# EAGLE design micromouse-edu-finalV2.0.0 (EAGLE 9.4.2)
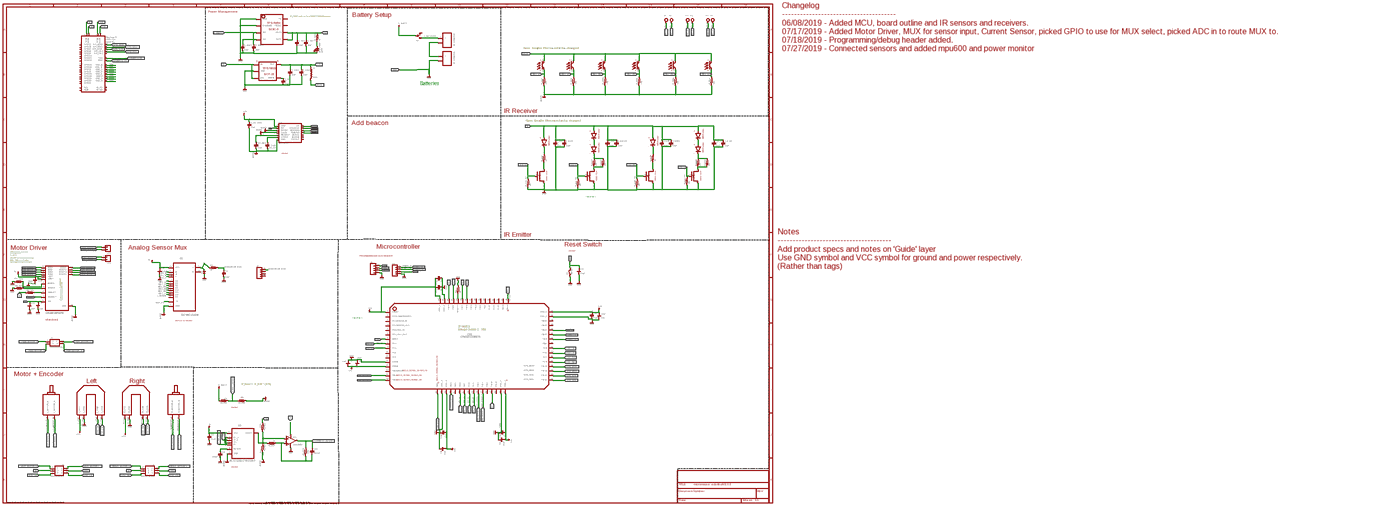
[diagram p0: schematic, sheet 1, overview]
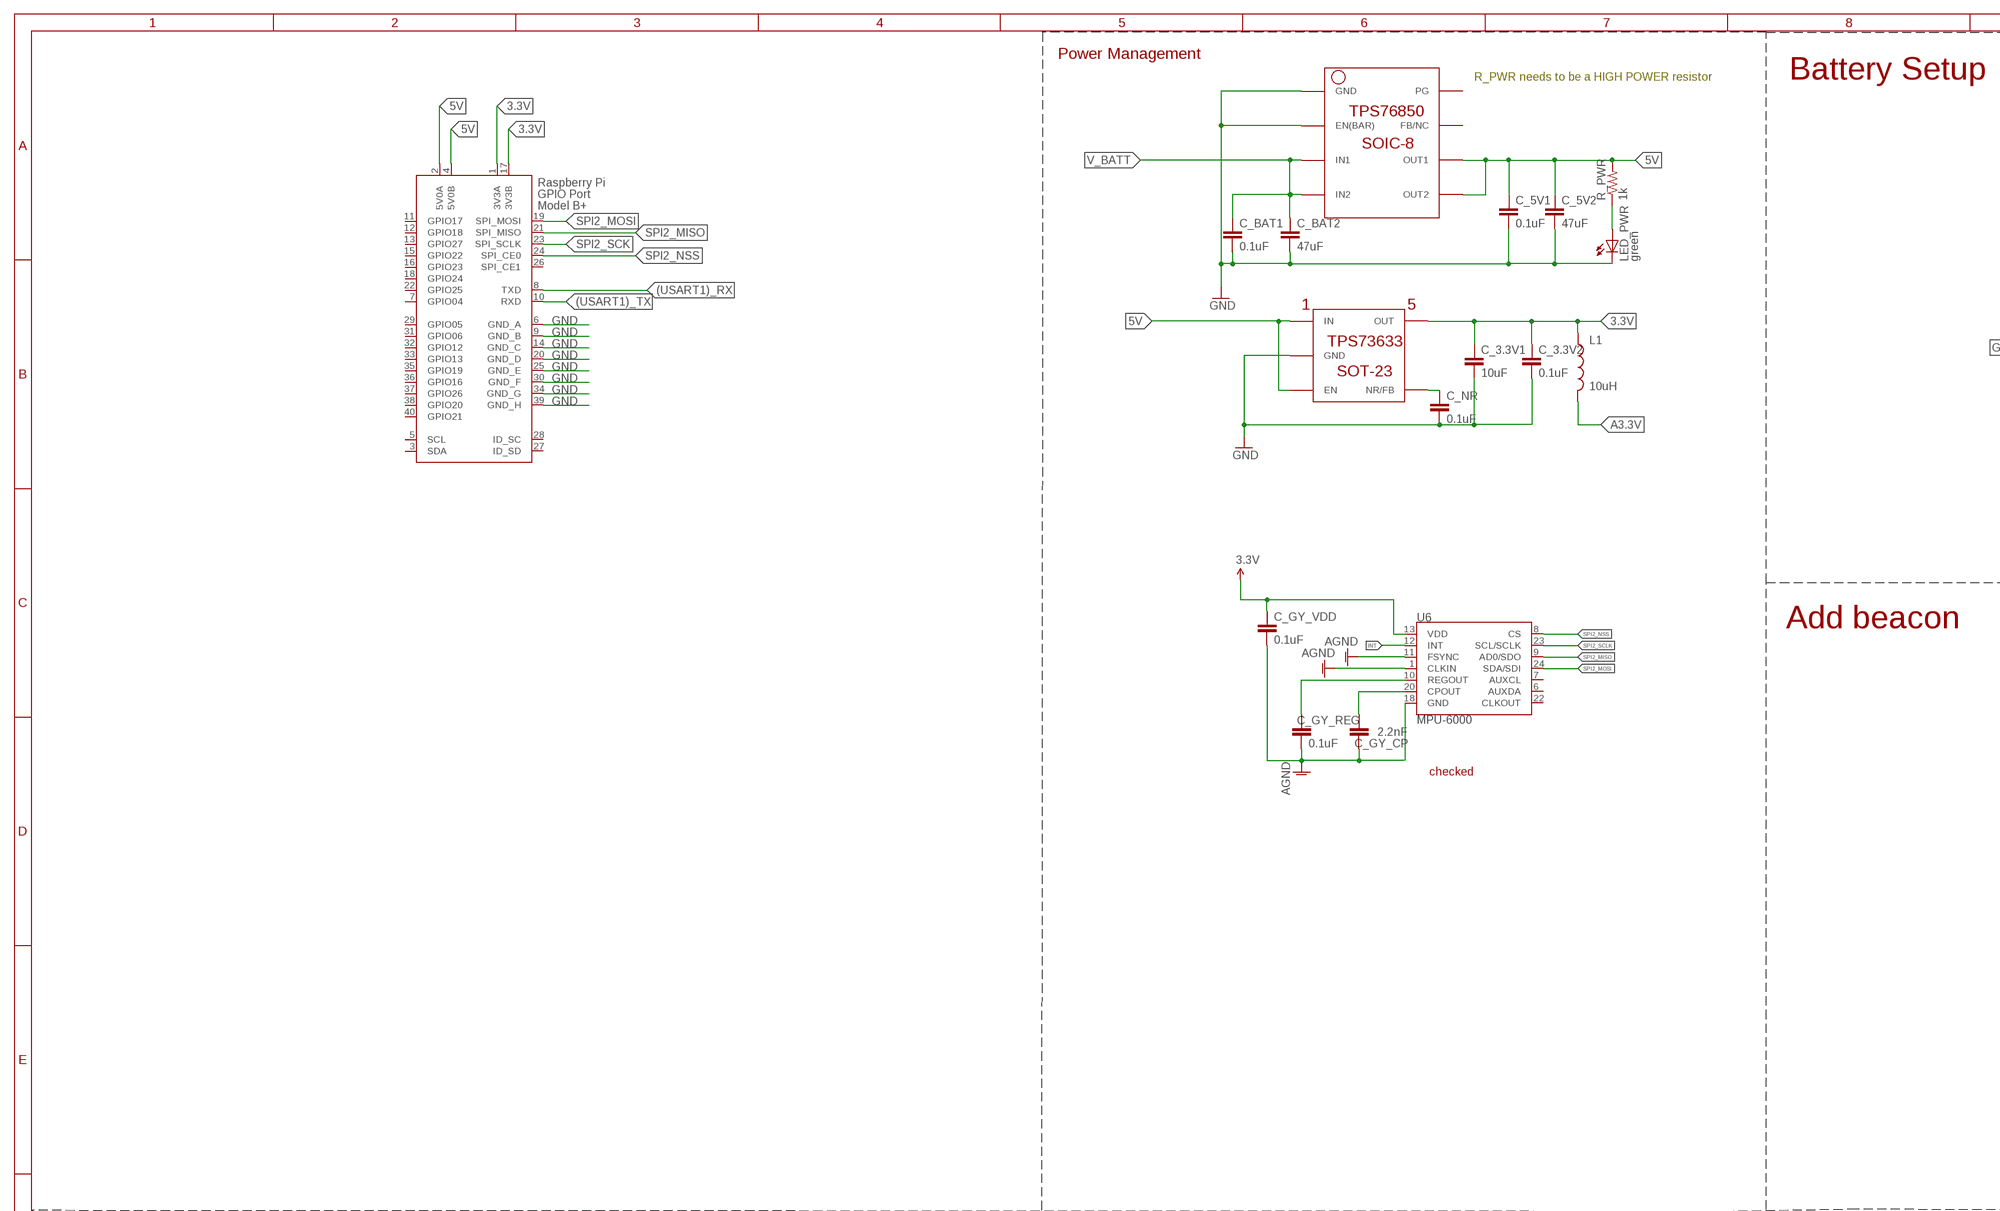
[diagram p1: schematic, sheet 1, part 1 of 6]
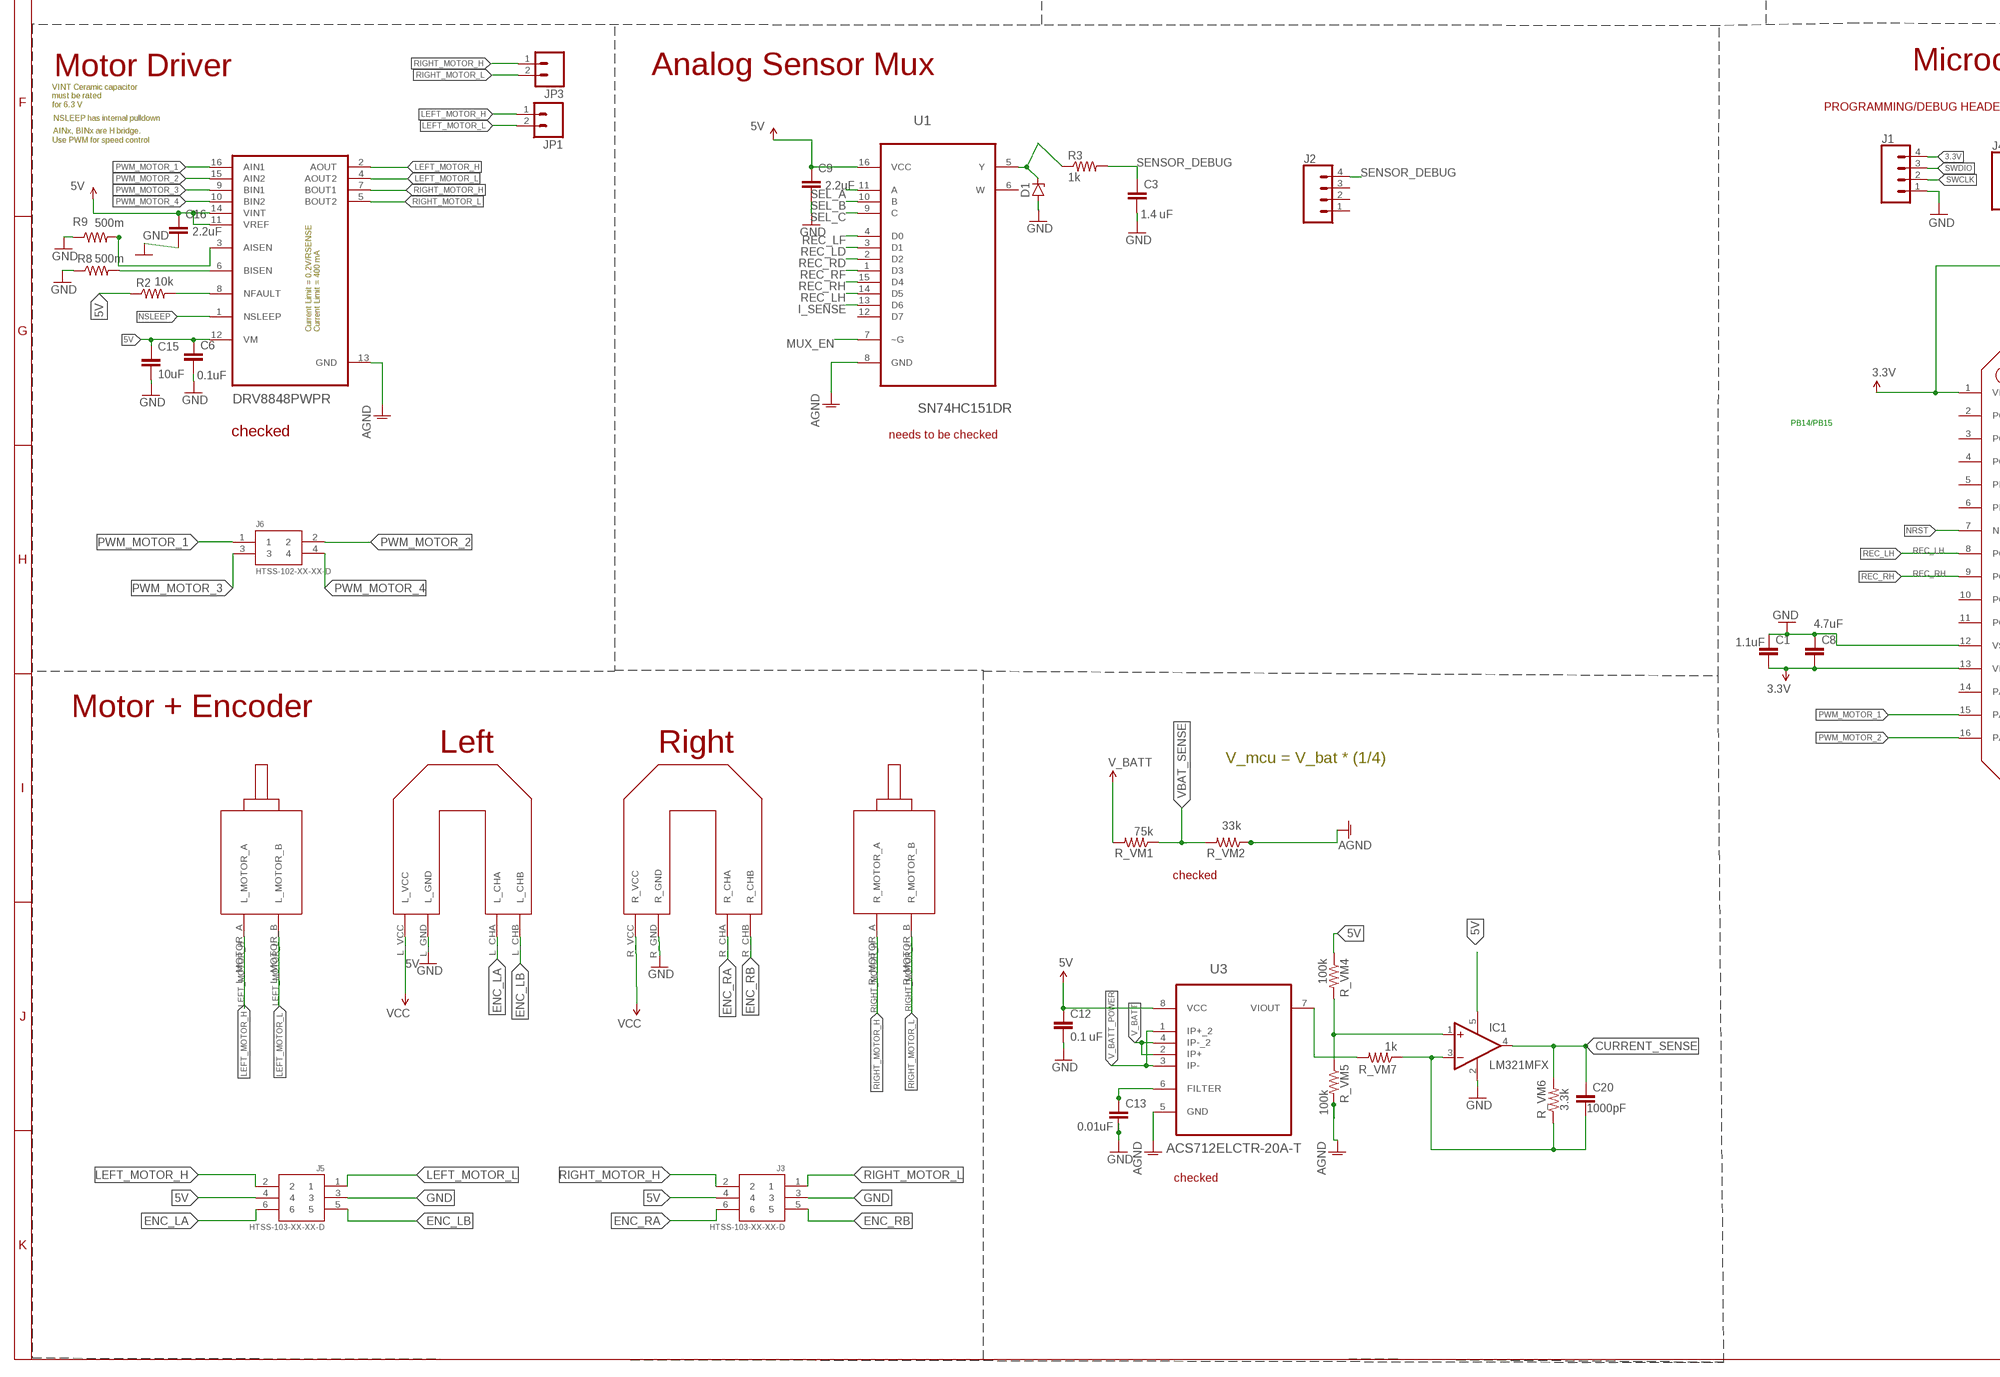
[diagram p2: schematic, sheet 1, part 2 of 6]
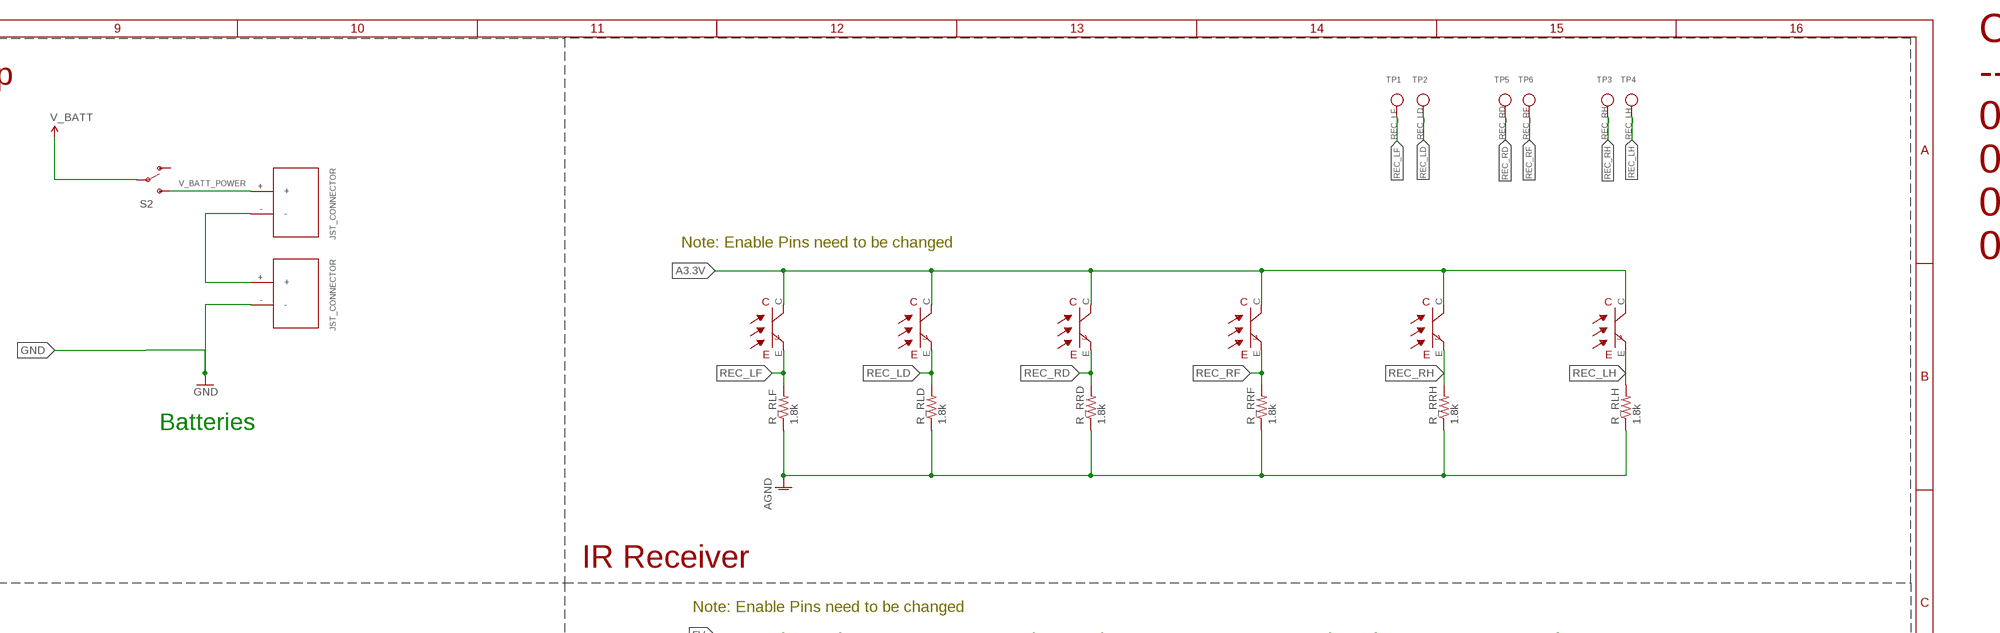
[diagram p3: schematic, sheet 1, part 3 of 6]
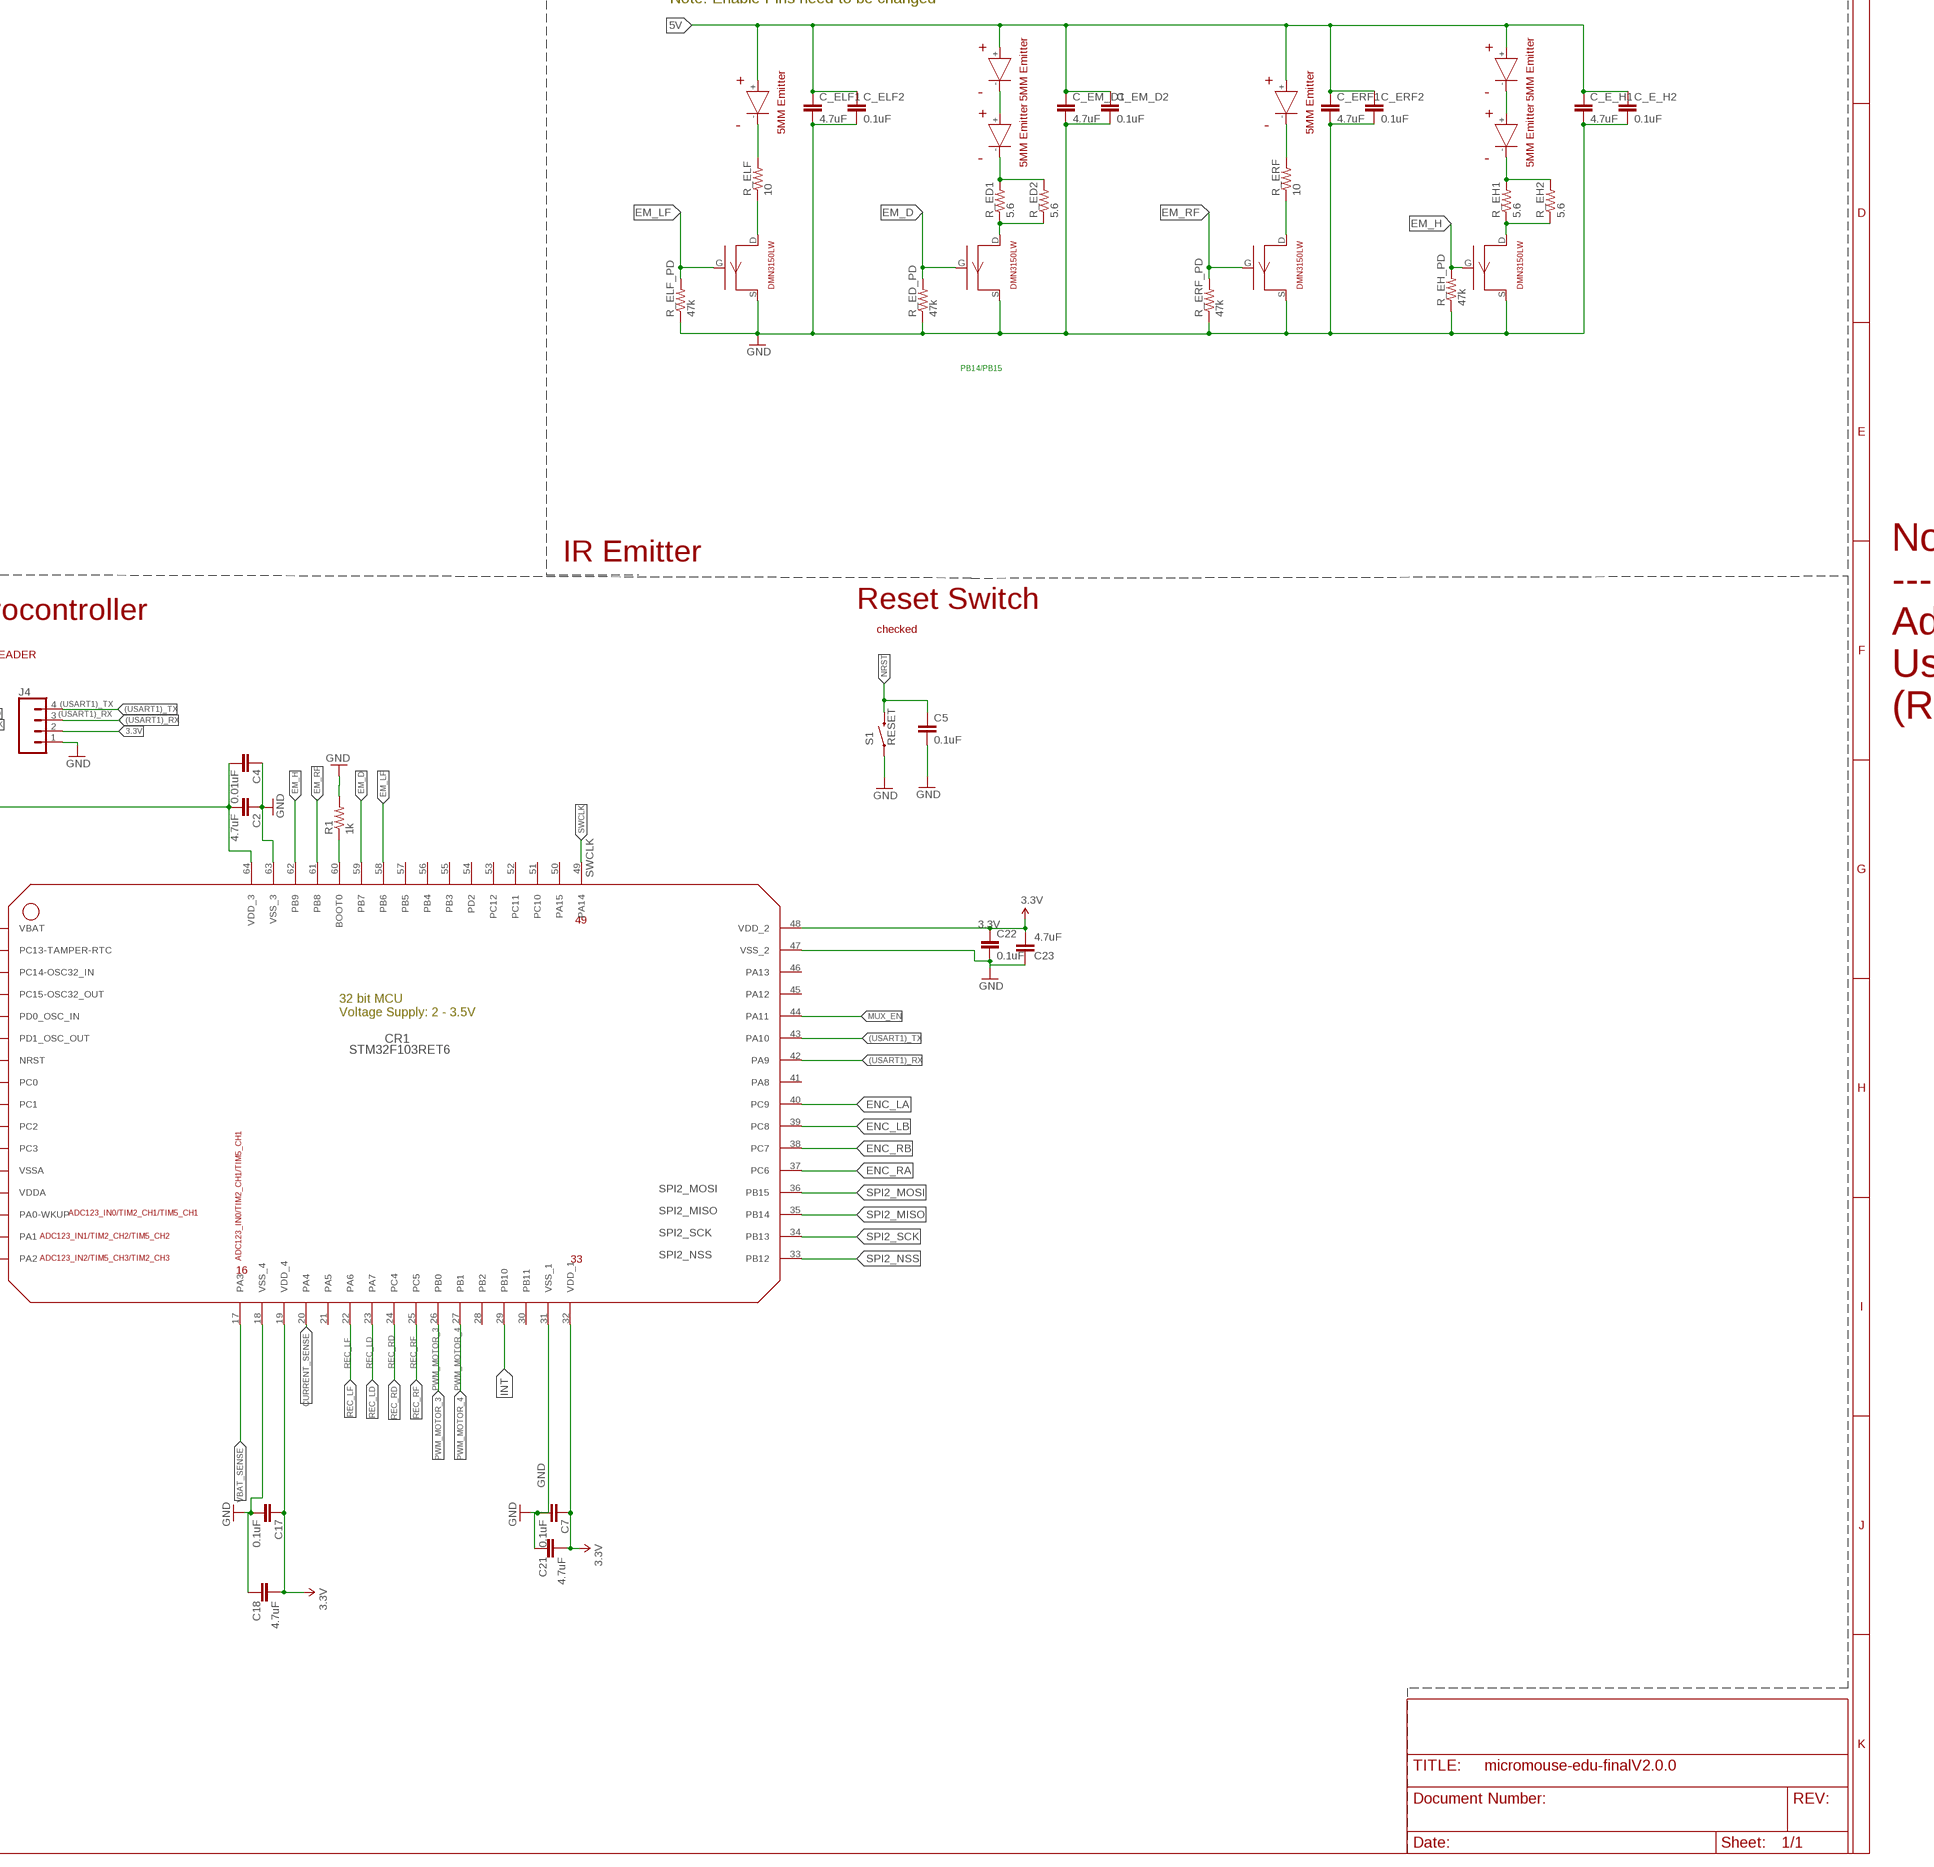
[diagram p4: schematic, sheet 1, part 4 of 6]
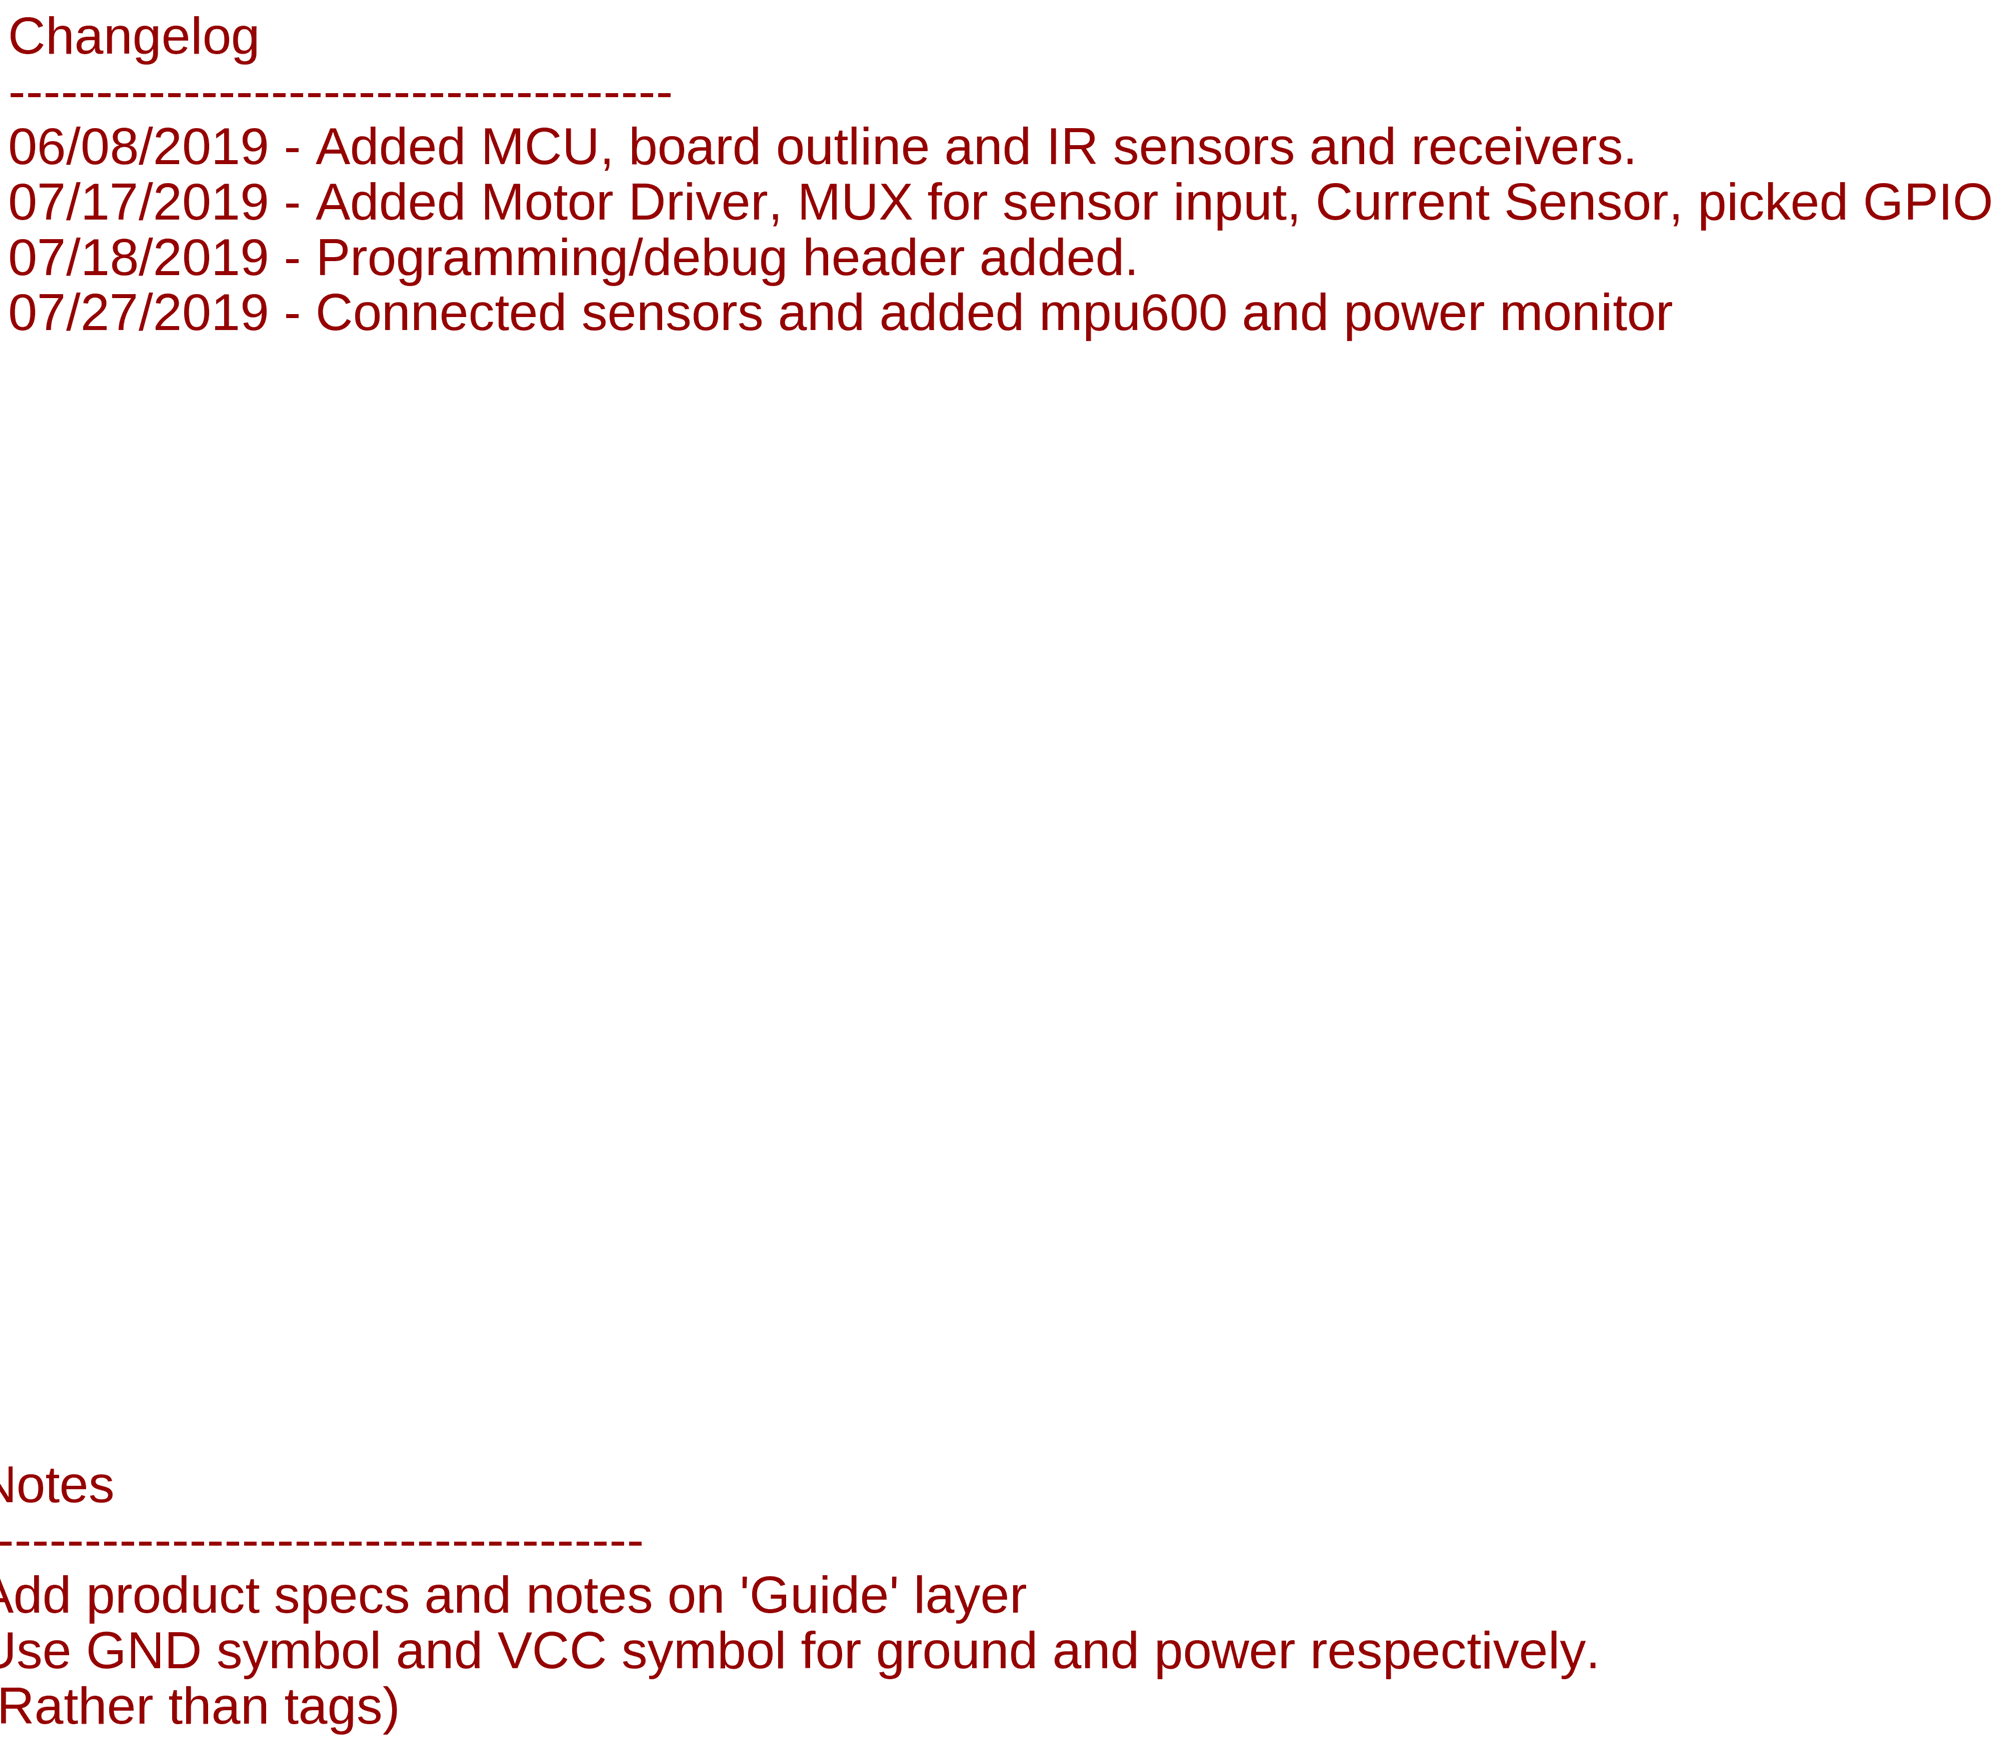
[diagram p5: schematic, sheet 1, part 5 of 6]
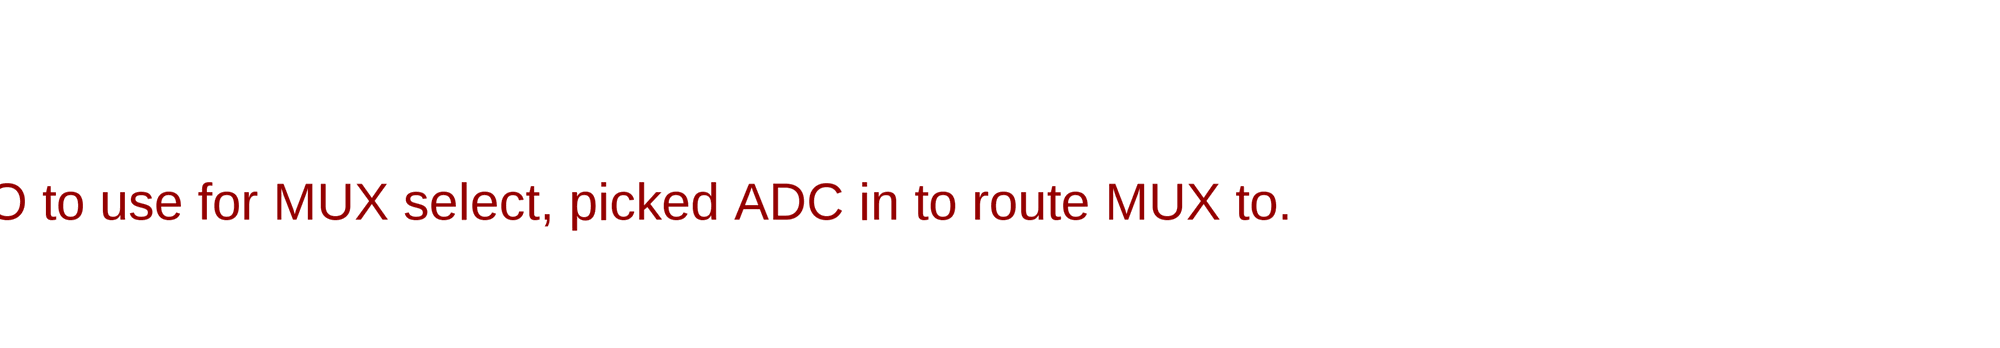
[diagram p6: schematic, sheet 1, part 6 of 6]

## Parts
C1  1.1uF  CAP0603-CAP  [0603-CAP]
C2  4.7uF  CAP0603-CAP  [0603-CAP]
C3  1.4 uF  CAP0603-CAP  [0603-CAP]
C4  0.01uF  CAP0603-CAP  [0603-CAP]
C5  0.1uF  CAP0603-CAP  [0603-CAP]
C6  0.1uF  CAP0603-CAP  [0603-CAP]
C7  0.1uF  CAP0603-CAP  [0603-CAP]
C8  4.7uF  CAP0603-CAP  [0603-CAP]
C9  2.2uF  CAP0603-CAP  [0603-CAP]
C12  0.1 uF  CAP0603-CAP  [0603-CAP]
C13  0.01uF  CAP0603-CAP  [0603-CAP]
C15  10uF  CAP0603-CAP  [0603-CAP]
C16  2.2uF  CAP0603-CAP  [0603-CAP]
C17  0.1uF  CAP0603-CAP  [0603-CAP]
C18  4.7uF  CAP0603-CAP  [0603-CAP]
C20  1000pF  CAP0603-CAP  [0603-CAP]
C21  4.7uF  CAP0603-CAP  [0603-CAP]
C22  0.1uF  CAP0603-CAP  [0603-CAP]
C23  4.7uF  CAP0603-CAP  [0603-CAP]
C_3.3V1  10uF  CAP0603-CAP  [0603-CAP]
C_3.3V2  0.1uF  CAP0603-CAP  [0603-CAP]
C_5V1  0.1uF  CAP0603-CAP  [0603-CAP]
C_5V2  47uF  CAP1210  [1210]
C_BAT1  0.1uF  CAP0603-CAP  [0603-CAP]
C_BAT2  47uF  CAP1210  [1210]
C_E_H1  4.7uF  CAP0603-CAP  [0603-CAP]
C_E_H2  0.1uF  CAP0603-CAP  [0603-CAP]
C_ELF1  4.7uF  CAP0603-CAP  [0603-CAP]
C_ELF2  0.1uF  CAP0603-CAP  [0603-CAP]
C_EM_D1  4.7uF  CAP0603-CAP  [0603-CAP]
C_EM_D2  0.1uF  CAP0603-CAP  [0603-CAP]
C_ERF1  4.7uF  CAP0603-CAP  [0603-CAP]
C_ERF2  0.1uF  CAP0603-CAP  [0603-CAP]
C_GY_CP  2.2nF  CAP0603-CAP  [0603-CAP]
C_GY_REG  0.1uF  CAP0603-CAP  [0603-CAP]
C_GY_VDD  0.1uF  CAP0603-CAP  [0603-CAP]
C_NR  0.1uF  CAP0603-CAP  [0603-CAP]
CR1  STM32F103RET6  [LQFP-64]
D1  ZENER-DIODESOT23  [SOT23]
IC1  LM321MFX  [SOT23-5]
J1  CONN_04  [1X04]
J2  CONN_04  [1X04]
J3  HTSS-103-XX-XX-D  [HTSS-103-XX-XX-D]
J4  CONN_04  [1X04]
J5  HTSS-103-XX-XX-D  [HTSS-103-XX-XX-D]
J6  HTSS-102-XX-XX-D  [HTSS-102-XX-XX-D]
JP1  M02POLAR  [MOLEX-1X2]
JP3  M02POLAR  [MOLEX-1X2]
L1  10uH  INDUCTOR1007  [1007]
LED_PWR  green  LED1206  [LED-1206]
LEFT_FRONT_EMITTER  EMITTER  [EMITTER]
NMOS1  DMN3150LW  [DMN3150LW]
NMOS2  DMN3150LW  [DMN3150LW]
NMOS3  DMN3150LW  [DMN3150LW]
NMOS4  DMN3150LW  [DMN3150LW]
R1  1k  R-US_M0805  [M0805]
R2  10k  RESISTOR0805-RES  [0805]
R3  1k  R-US_R0805  [R0805]
R8  500m  RESISTOR0805-RES  [0805]
R9  500m  RESISTOR0805-RES  [0805]
R_ED1  5.6  RESISTOR0603-RES  [0603-RES]
R_ED2  5.6  RESISTOR0603-RES  [0603-RES]
R_ED_PD  47k  RESISTOR0603-RES  [0603-RES]
R_EH1  5.6  RESISTOR0603-RES  [0603-RES]
R_EH2  5.6  RESISTOR0603-RES  [0603-RES]
R_EH_PD  47k  RESISTOR0603-RES  [0603-RES]
R_ELF  10  RESISTOR0603-RES  [0603-RES]
R_ELF_PD  47k  RESISTOR0603-RES  [0603-RES]
R_ERF  10  RESISTOR0603-RES  [0603-RES]
R_ERF_PD  47k  RESISTOR0603-RES  [0603-RES]
R_PWR  1k  RESISTOR0603-RES  [0603-RES]
R_RLD  1.8k  RESISTOR0603-RES  [0603-RES]
R_RLF  1.8k  RESISTOR0603-RES  [0603-RES]
R_RLH  1.8k  RESISTOR0603-RES  [0603-RES]
R_RRD  1.8k  RESISTOR0603-RES  [0603-RES]
R_RRF  1.8k  RESISTOR0603-RES  [0603-RES]
R_RRH  1.8k  RESISTOR0603-RES  [0603-RES]
R_VM1  75k  RESISTOR0603-RES  [0603-RES]
R_VM2  33k  RESISTOR0603-RES  [0603-RES]
R_VM4  100k  RESISTOR0603-RES  [0603-RES]
R_VM5  100k  RESISTOR0603-RES  [0603-RES]
R_VM6  3.3k  RESISTOR0603-RES  [0603-RES]
R_VM7  1k  RESISTOR0603-RES  [0603-RES]
REC_LF  RECEIVER  [RECEIVER]
S1  RESET  SWITCH-MOMENTARY-2SMD-4.6X2.8MM  [TACTILE_SWITCH_SMD_4.6X2.8MM]
S2  SWITCH-SPSTPTH  [SWITCH-SPDT]
TP1  TESTPOINTROUND2MM  [TESTPOINT_ROUND_2MM]
TP2  TESTPOINTROUND2MM  [TESTPOINT_ROUND_2MM]
TP3  TESTPOINTROUND2MM  [TESTPOINT_ROUND_2MM]
TP4  TESTPOINTROUND2MM  [TESTPOINT_ROUND_2MM]
TP5  TESTPOINTROUND2MM  [TESTPOINT_ROUND_2MM]
TP6  TESTPOINTROUND2MM  [TESTPOINT_ROUND_2MM]
U1  SN74HC151DR  [SOIC127P600X175-16N]
U2  DRV8848PWPR  [SOP65P640X120-17N]
U3  ACS712ELCTR-20A-T  [SOIC127P600X175-8N]
U6  MPU-6000  [QFN-24-EP]
U$1  JST_CONNECTOR_FEMALE  [JST_CONNECTOR_FEMALE]
U$2  JST_CONNECTOR_FEMALE  [JST_CONNECTOR_FEMALE]
U$3  TPS73633(SOT-23)  [TPS73633(SOT-23)]
U$4  TPS76850(SOIC-8)  [TPS76850(SOIC-8)]
U$7  RECEIVER  [RECEIVER]
U$8  RECEIVER  [RECEIVER]
U$9  RECEIVER  [RECEIVER]
U$11  EMITTER  [EMITTER]
U$12  MY_MM_MOTOR_MOUNT  [MY_MM_MOTOR_MOUNT]
U$13  EMITTER  [EMITTER]
U$17  EMITTER  [EMITTER]
U$18  EMITTER  [EMITTER]
U$19  EMITTER  [EMITTER]
U$20  RECEIVER  [RECEIVER]
U$21  RECEIVER  [RECEIVER]
X1  RASPI_GPIO_B+#_PIN  [RASPI_GPIO_B+_PIN]

## Nets
3.3V: C1.2 C2.2 C4.2 C7.1 C8.2 C17.1 C18.2 C21.2 C22.1 C23.2 C_3.3V1.1 C_3.3V2.1 C_GY_VDD.1 CR1.1(VBAT) CR1.13(VDDA) CR1.19(VDD_4) CR1.32(VDD_1) CR1.48(VDD_2) CR1.64(VDD_3) J1.4 J4.2 L1.1 U6.13(VDD) U$3.OUT X1.1(3V3A) X1.17(3V3B)
5V: C6.1 C9.1 C12.1 C15.1 C16.1 C_5V1.1 C_5V2.1 C_E_H1.1 C_E_H2.1 C_ELF1.1 C_ELF2.1 C_EM_D1.1 C_EM_D2.1 C_ERF1.1 C_ERF2.1 IC1.5(V+) J3.4 J5.4 LEFT_FRONT_EMITTER.+ R2.1 R_PWR.2 R_VM4.1 U1.16(VCC) U2.11(VREF) U2.12(VM) U2.14(VINT) U3.8(VCC) U$3.EN U$3.IN U$4.OUT1 U$4.OUT2 U$11.+ U$12.L_VCC U$12.R_VCC U$13.+ U$18.+ X1.2(5V0A) X1.4(5V0B) ; supply symbol labelled VCC
(USART1)_RX: CR1.42(PA9) J4.3 X1.8(TXD)
(USART1)_TX: CR1.43(PA10) J4.4 X1.10(RXD)
A3.3V: L1.2 REC_LF.C U$7.C U$8.C U$9.C U$20.C U$21.C
AGND: C_GY_CP.2 C_GY_REG.2 C_GY_VDD.2 R_RLD.1 R_RLF.1 R_RLH.1 R_RRD.1 R_RRF.1 R_RRH.1 R_VM2.1 R_VM5.2 U1.8(GND) U2.13(GND) U3.5(GND) U6.1(CLKIN) U6.11(FSYNC) U6.18(GND)
BATT_CONN: U$1.+ U$2.-
CURRENT_SENSE: C20.1 CR1.20(PA4) IC1.4(OUT) R_VM6.2
D2_EM: R_ED1.2 R_ED2.2 U$17.-
D_EM: U$11.- U$17.+
EM_D: CR1.59(PB7) NMOS2.G R_ED_PD.2
EM_H: CR1.62(PB9) NMOS4.G R_EH_PD.2
EM_LF: CR1.58(PB6) NMOS1.G R_ELF_PD.2
EM_RF: CR1.61(PB8) NMOS3.G R_ERF_PD.2
ENC_LA: CR1.40(PC9) J5.6 U$12.L_CHA
ENC_LB: CR1.39(PC8) J5.5 U$12.L_CHB
ENC_RA: CR1.37(PC6) J3.6 U$12.R_CHA
ENC_RB: CR1.38(PC7) J3.5 U$12.R_CHB
GND: C1.1 C2.1 C3.2 C4.1 C5.2 C6.2 C7.2 C8.1 C9.2 C12.2 C13.2 C15.2 C16.2 C17.2 C18.1 C21.1 C22.2 C23.1 C_3.3V1.2 C_3.3V2.2 C_5V1.2 C_5V2.2 C_BAT1.2 C_BAT2.2 C_E_H1.2 C_E_H2.2 C_ELF1.2 C_ELF2.2 C_EM_D1.2 C_EM_D2.2 C_ERF1.2 C_ERF2.2 C_NR.2 CR1.12(VSSA) CR1.18(VSS_4) CR1.31(VSS_1) CR1.47(VSS_2) CR1.63(VSS_3) D1.1(A) IC1.2(V-) J1.1 J3.3 J4.1 J5.3 LED_PWR.C NMOS1.S NMOS2.S NMOS3.S NMOS4.S R1.2 R8.1 R9.1 R_ED_PD.1 R_EH_PD.1 R_ELF_PD.1 R_ERF_PD.1 S1.1 S1.2 U$1.- U$3.GND U$4.EN(BAR) U$4.GND U$12.L_GND U$12.R_GND X1.6(GND_A) X1.9(GND_B) X1.14(GND_C) X1.20(GND_D) X1.25(GND_E) X1.30(GND_F) X1.34(GND_G) X1.39(GND_H)
H2_EM: R_EH1.2 R_EH2.2 U$19.-
H_EM: U$18.- U$19.+
I_SENSE: U1.13(D6)
INT: CR1.29(PB10) U6.12(INT)
LEFT_MOTOR_H: J5.2 JP1.1 U2.2(AOUT) U$12.L_MOTOR_A
LEFT_MOTOR_L: J5.1 JP1.2 U2.4(AOUT2) U$12.L_MOTOR_B
LF_EM: LEFT_FRONT_EMITTER.- R_ELF.2
MUX_EN: CR1.44(PA11) U1.7(~G)
N$1: C13.1 U3.6(FILTER)
N$2: D1.3(C) R3.1 U1.5(Y)
N$5: NMOS3.D R_ERF.1
N$7: NMOS1.D R_ELF.1
N$9: CR1.60(BOOT0) R1.1
N$12: R2.2 U2.8(NFAULT)
N$15: R9.2 U2.3(AISEN)
N$18: NMOS2.D R_ED1.1 R_ED2.1
N$19: NMOS4.D R_EH1.1 R_EH2.1
N$20: R8.2 U2.6(BISEN)
N$21: IC1.1(+IN) R_VM4.2 R_VM5.1
N$24: R_VM7.2 U3.7(VIOUT)
N$26: C_NR.1 U$3.NR/FB
N$27: LED_PWR.A R_PWR.1
N$28: C_GY_REG.1 U6.10(REGOUT)
N$29: C_GY_CP.1 U6.20(CPOUT)
N$31: C20.2 IC1.3(-IN) R_VM6.1 R_VM7.1
NRST: C5.1 CR1.7(NRST) S1.3 S1.4
NSLEEP: U2.1(NSLEEP)
PWM_MOTOR_1: CR1.15(PA1) J6.1 U2.16(AIN1)
PWM_MOTOR_2: CR1.16(PA2) J6.2 U2.15(AIN2)
PWM_MOTOR_3: CR1.26(PB0) J6.3 U2.9(BIN1)
PWM_MOTOR_4: CR1.27(PB1) J6.4 U2.10(BIN2)
REC_LD: CR1.23(PA7) R_RLD.2 TP2.P$1 U1.3(D1) U$7.E
REC_LF: CR1.22(PA6) R_RLF.2 REC_LF.E TP1.P$1 U1.4(D0)
REC_LH: CR1.8(PC0) R_RLH.2 TP4.P$1 U1.14(D5) U$21.E
REC_RD: CR1.24(PC4) R_RRD.2 TP5.P$1 U1.2(D2) U$8.E
REC_RF: CR1.25(PC5) R_RRF.2 TP6.P$1 U1.1(D3) U$9.E
REC_RH: CR1.9(PC1) R_RRH.2 TP3.P$1 U1.15(D4) U$20.E
RF_EM: R_ERF.2 U$13.-
RIGHT_MOTOR_H: J3.2 JP3.1 U2.7(BOUT1) U$12.R_MOTOR_A
RIGHT_MOTOR_L: J3.1 JP3.2 U2.5(BOUT2) U$12.R_MOTOR_B
SEL_A: U1.11(A)
SEL_B: U1.10(B)
SEL_C: U1.9(C)
SENSOR_DEBUG: C3.1 J2.4 R3.2
SPI2_MISO: CR1.35(PB14) U6.9(AD0/SDO) X1.21(SPI_MISO)
SPI2_MOSI: CR1.36(PB15) U6.24(SDA/SDI) X1.19(SPI_MOSI)
SPI2_NSS: CR1.33(PB12) U6.8(CS) X1.24(SPI_CE0)
SPI2_SCK: CR1.34(PB13) X1.23(SPI_SCLK)
SPI2_SCLK: U6.23(SCL/SCLK)
SWCLK: CR1.49(PA14) J1.2
SWDIO: J1.3
V_BATT: C_BAT1.1 C_BAT2.1 R_VM1.2 S2.2(P) U3.2(IP+) U3.4(IP-_2) U$4.IN1 U$4.IN2
V_BATT_POWER: S2.3(S) U3.1(IP+_2) U3.3(IP-) U$2.+
VBAT_SENSE: CR1.17(PA3) R_VM1.1 R_VM2.2
Unconnected: CR1.2(PC13-TAMPER-RTC) CR1.3(PC14-OSC32_IN) CR1.4(PC15-OSC32_OUT) CR1.5(PD0_OSC_IN) CR1.6(PD1_OSC_OUT) CR1.10(PC2) CR1.11(PC3) CR1.14(PA0-WKUP) CR1.21(PA5) CR1.28(PB2) CR1.30(PB11) CR1.41(PA8) CR1.45(PA12) CR1.46(PA13) CR1.50(PA15) CR1.51(PC10) CR1.52(PC11) CR1.53(PC12) CR1.54(PD2) CR1.55(PB3) CR1.56(PB4) CR1.57(PB5) J2.1 J2.2 J2.3 S2.1(O) U1.6(W) U1.12(D7) U6.6(AUXDA) U6.7(AUXCL) U6.22(CLKOUT) U$4.FB/NC U$4.PG X1.3(SDA) X1.5(SCL) X1.7(GPIO04) X1.11(GPIO17) X1.12(GPIO18) X1.13(GPIO27) X1.15(GPIO22) X1.16(GPIO23) X1.18(GPIO24) X1.22(GPIO25) X1.26(SPI_CE1) X1.27(ID_SD) X1.28(ID_SC) X1.29(GPIO05) X1.31(GPIO06) X1.32(GPIO12) X1.33(GPIO13) X1.35(GPIO19) X1.36(GPIO16) X1.37(GPIO26) X1.38(GPIO20) X1.40(GPIO21)

## Notes on the sheet
- Power Management
- R_PWR needs to be a HIGH POWER resistor | Battery Setup
- Note: Enable Pins need to be changed
- Changelog
  --------------------------------------
  06/08/2019 - Added MCU, board outline and IR sensors and receivers.                                      
  07/17/2019 - Added Motor Driver, MUX for sensor input, Current Sensor, picked GPIO to use for MUX select, picked ADC in to route MUX to. 
  07/18/2019 - Programming/debug header added.
  07/27/2019 - Connected sensors and added mpu600 and power monitor
- Batteries
- IR Receiver
- Note: Enable Pins need to be changed
- Add beacon
- checked
- PB14/PB15
- IR Emitter
- Reset Switch
- Motor Driver | Analog Sensor Mux | Microcontroller
- checked
- VINT Ceramic capacitor 
  must be rated 
  for 6.3 V
- PROGRAMMING/DEBUG HEADER
- NSLEEP has internal pulldown
- AINx, BINx are H bridge.
- Use PWM for speed control
- Notes
  --------------------------------------
  Add product specs and notes on 'Guide' layer
  Use GND symbol and VCC symbol for ground and power respectively.
  (Rather than tags)
- Current Limit = 0.2V/RSENSE
  Current Limit = 400 mA
- PB14/PB15
- checked | needs to be checked
- 32 bit MCU
  Voltage Supply: 2 - 3.5V
- ADC123_IN0/TIM2_CH1/TIM5_CH1
- Motor + Encoder | ADC123_IN1/TIM2_CH2/TIM5_CH2
- ADC123_IN2/TIM5_CH3/TIM2_CH3 | ADC123_IN0/TIM2_CH1/TIM5_CH1
- V_mcu = V_bat * (1/4)
- 33k
- checked
- checked

## Library data of the parts
C1-C9 C12 C13 C15-C18 C20-C23 C_E_H1 C_E_H2 C_ELF1 C_ELF2 C_EM_D1 C_EM_D2 C_ERF1 C_ERF2 = MicromouseV0.0.4:CAP: Capacitor Standard 0603 ceramic capacitor, and 0.1" leaded capacitor.
C_3.3V1 C_3.3V2 C_5V1 C_5V2 C_BAT2 C_GY_CP C_GY_REG C_GY_VDD C_NR = SparkFun:CAP: Capacitor Standard 0603 ceramic capacitor, and 0.1" leaded capacitor.
C_BAT1 = SparkFun-Capacitors:CAP: Capacitor Standard 0603 ceramic capacitor, and 0.1" leaded capacitor.
CR1 = MicromouseV0.0.4:STM32F103RET6; MANUFACTURER_PART_NUMBER: STM32F103RET6; VENDOR: STMicroelectronics
D1 = diode:ZENER-DIODE: Z-Diode
IC1 = linear:LM321?*: Low Power Single Op Amp Source: http://cache.national.com/ds/LM/LM321.pdf
J1 J4 = MicromouseV0.0.4:CONN_04: Multi connection point. Often used as Generic Header-pin footprint for 0.1 inch spaced/style header connections On any of the 0.1 inch spaced packages, you can populate with these: Break Away Headers - Straight <https://www.sparkfun.com/products/116> (PRT-00116) Break Away Male Headers - Right Angle <https://www.sparkfun.com/products/553> (PRT-00553) Female Headers <https://www.sparkfun.com/products/115> (PRT-00115) Break Away Headers - Machine Pin <https://www.sparkfun.com/products/117> (PRT-00117) Break Away Female Headers - Swiss Machine Pin <https://www.sparkfun.com/products/743> (PRT-00743) For SCREWTERMINALS and SPRING TERMINALS visit here: Screw Terimnals on SparkFun.com <https://www.sparkfun.com/search/results?term=Screw+Terminals> (5mm/3.5mm/2.54mm spacing) This device is also useful as a general connection point to wire up your design to another part of your project. Our various solder wires solder well into these plated through hole pads. Hook-Up Wire - Assortment (Stranded, 22 AWG) <https://www.sparkfun.com/products/11375> (PRT-11375) Hook-Up Wire - Assortment (Solid Core, 22 AWG) <https://www.sparkfun.com/products/11367> (PRT-11367) View the entire wire category on our website here <https://www.sparkfun.com/categories/141> Special notes: Molex polarized connector foot print use with SKU : PRT-08231 with associated crimp pins and housings. 1MM SMD Version SKU: PRT-10208; PROD_ID: CONN-09696
J2 = SparkFun-Connectors:CONN_04: Multi connection point. Often used as Generic Header-pin footprint for 0.1 inch spaced/style header connections On any of the 0.1 inch spaced packages, you can populate with these: Break Away Headers - Straight <https://www.sparkfun.com/products/116> (PRT-00116) Break Away Male Headers - Right Angle <https://www.sparkfun.com/products/553> (PRT-00553) Female Headers <https://www.sparkfun.com/products/115> (PRT-00115) Break Away Headers - Machine Pin <https://www.sparkfun.com/products/117> (PRT-00117) Break Away Female Headers - Swiss Machine Pin <https://www.sparkfun.com/products/743> (PRT-00743) For SCREWTERMINALS and SPRING TERMINALS visit here: Screw Terimnals on SparkFun.com <https://www.sparkfun.com/search/results?term=Screw+Terminals> (5mm/3.5mm/2.54mm spacing) This device is also useful as a general connection point to wire up your design to another part of your project. Our various solder wires solder well into these plated through hole pads. Hook-Up Wire - Assortment (Stranded, 22 AWG) <https://www.sparkfun.com/products/11375> (PRT-11375) Hook-Up Wire - Assortment (Solid Core, 22 AWG) <https://www.sparkfun.com/products/11367> (PRT-11367) View the entire wire category on our website here <https://www.sparkfun.com/categories/141> Special notes: Molex polarized connector foot print use with SKU : PRT-08231 with associated crimp pins and housings. 1MM SMD Version SKU: PRT-10208; PROD_ID: CONN-09696
J3 J5 = HTSS-103-01-G-D:HTSS-103-XX-XX-D: HIGH TEMP TOP SHROUD TERMINAL STRIP.
J6 = HTSS-102-01-G-D:HTSS-102-XX-XX-D: HIGH TEMP TOP SHROUD TERMINAL STRIP.
JP1 JP3 = EGSE_SIMv0.0.3:M02: Header 2 Standard 2-pin 0.1" header. Use with straight break away headers (SKU : PRT-00116), right angle break away headers (PRT-00553), swiss pins (PRT-00743), machine pins (PRT-00117), and female headers (PRT-00115). Molex polarized connector foot print use with SKU : PRT-08233 with associated crimp pins and housings.
L1 = SparkFun-Passives:INDUCTOR: Inductors Basic Inductor/Choke - 0603 and 1206. Footprints are not proven and vary greatly between part numbers. INDUCTOR POWER 3.3UH 4.0A SMD 0.197" L x 0.197" W x 0.177" H (5.00mm x 5.00mm x 4.50mm)
LED_PWR = SparkFun:LED: LEDs Standard schematic elements and footprints for 5mm, 3mm, 1206, and 0603 sized LEDs. 5mm - Spark Fun Electronics SKU : COM-00529 (and others)
LEFT_FRONT_EMITTER U$11 U$13 U$17-U$19 = MicromouseV0.0.4:EMITTER
NMOS1-NMOS4 = MicromouseV0.0.4:DMN3150LW
R1 R3 = rcl:R-US_: RESISTOR, American symbol; SPICEPREFIX: R
R2 R8 R9 R_ED1 R_ED2 R_ED_PD R_EH1 R_EH2 R_EH_PD R_ELF R_ELF_PD R_ERF R_ERF_PD R_RLD R_RLF R_RLH R_RRD R_RRF R_RRH = MicromouseV0.0.4:RESISTOR: Resistor Basic schematic elements and footprints for 0603, 1206, and PTH resistors.
R_PWR R_VM1 R_VM2 R_VM4-R_VM7 = SparkFun-Passives:RESISTOR: Resistor Basic schematic elements and footprints for 0603, 1206, and PTH resistors.
REC_LF U$7-U$9 U$20 U$21 = MicromouseV0.0.4:RECEIVER
S1 = SparkFun-Electromechanical:SWITCH-MOMENTARY-2: Various NO switches- pushbuttons, reed, etc; PROD_ID: SWCH-13065
S2 = SparkFun:SWITCH-SPST: SPST Switch Simple slide switch. Spark Fun Electronics SKU : COM-00102
TP1-TP6 = microbuilder:TESTPOINT: Test Point Various test points for characterisation and PCB testing TESTPOINT_SMT - Compact Surface Mount Test Point [Digikey: 5016KTR-ND]
U1 = MicromouseV0.0.4:SN74HC151DR: 8-Line to 1-Line Dataselectors /MultiPlexers; AVAILABILITY: Unavailable; DESCRIPTION: 8-Line To 1-Line Data Selectors/Multiplexers 16-SOIC -40 to 85; MF: Texas Instruments; MP: SN74HC151DR; PACKAGE: SOIC-16 Texas Instruments; PRICE: None
U2 = MicromouseV0.0.4:DRV8848PWPR: None; AVAILABILITY: Unavailable; DESCRIPTION: 2A Dual H-Bridge Motor Driver _PWM Control_ 16-HTSSOP -40 to 85; MF: Texas Instruments; MP: DRV8848PWPR; PACKAGE: HTSSOP-16 Texas Instruments; PRICE: None
U3 = MicromouseV0.0.4:ACS712ELCTR-20A-T: Linear Current Sensor; AVAILABILITY: Unavailable; DESCRIPTION: Fully Integrated, Hall Effect-Based Linear Current Sensor IC with 2.1 kVRMS Voltage Isolation and a Low-Resistance Cu...; MF: Allegro; MP: ACS712ELCTR-20A-T; PACKAGE: SOIC-8 Allegro MicroSystems LLC; PRICE: None
U6 = SparkFun-Sensors:MPU-6000: Invensense MPU-6000 6-Axis Gryoscope/Accelerometer 3-axis gyroscope, 3-axis accelerometer in a 4x4 package. The MPU-6000 is the world’s first 6-axis I²C MotionTracking device designed for the low power, low cost, and high performance requirements of smartphones, tablets and wearable sensors. Datasheet <http://cdn.sparkfun.com/datasheets/Components/General%20IC/PS-MPU-6000A.pdf> SparkFun Products MPU-6000 - Motion Processing Unit <https://www.sparkfun.com/products/11234> (SEN-11234) SparkFun UDB5 - PIC UAV Development Board <https://www.sparkfun.com/products/11703> (GPS-11703); PROD_ID: IC-11089; SF_ID: SEN-11234
U$1 U$2 = JST_CONNECTOR_FEMALE. through hole:JST_CONNECTOR_FEMALE
U$3 = TPS73633(SOT-23):TPS73633(SOT-23)
U$4 = TPS76850(SOIC-8):TPS76850(SOIC-8)
U$12 = MicromouseV0.0.4:MY_MM_MOTOR_MOUNT
X1 = raspberrypi_bastelstube_v13:RASPI_GPIO_B+#: 2x20 header connector, all pins connected

## Net classes
0 default: width 0.254 mm, drill 0.178 mm, clearance 0.178 mm

## Board
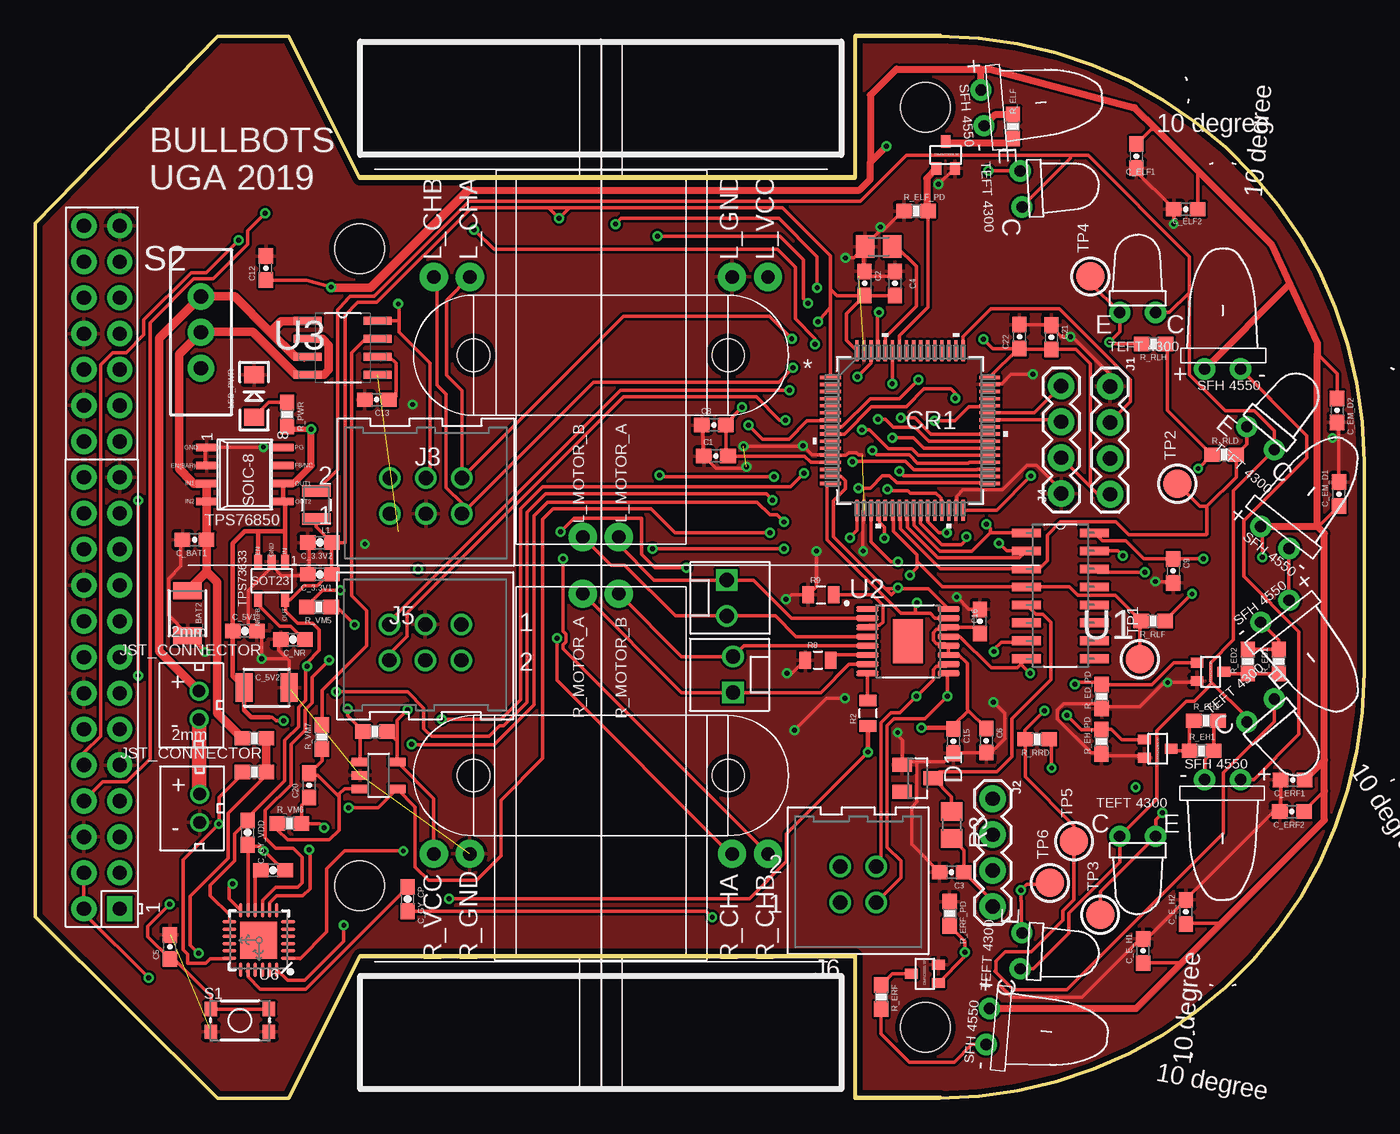
[diagram p7: board, top side]
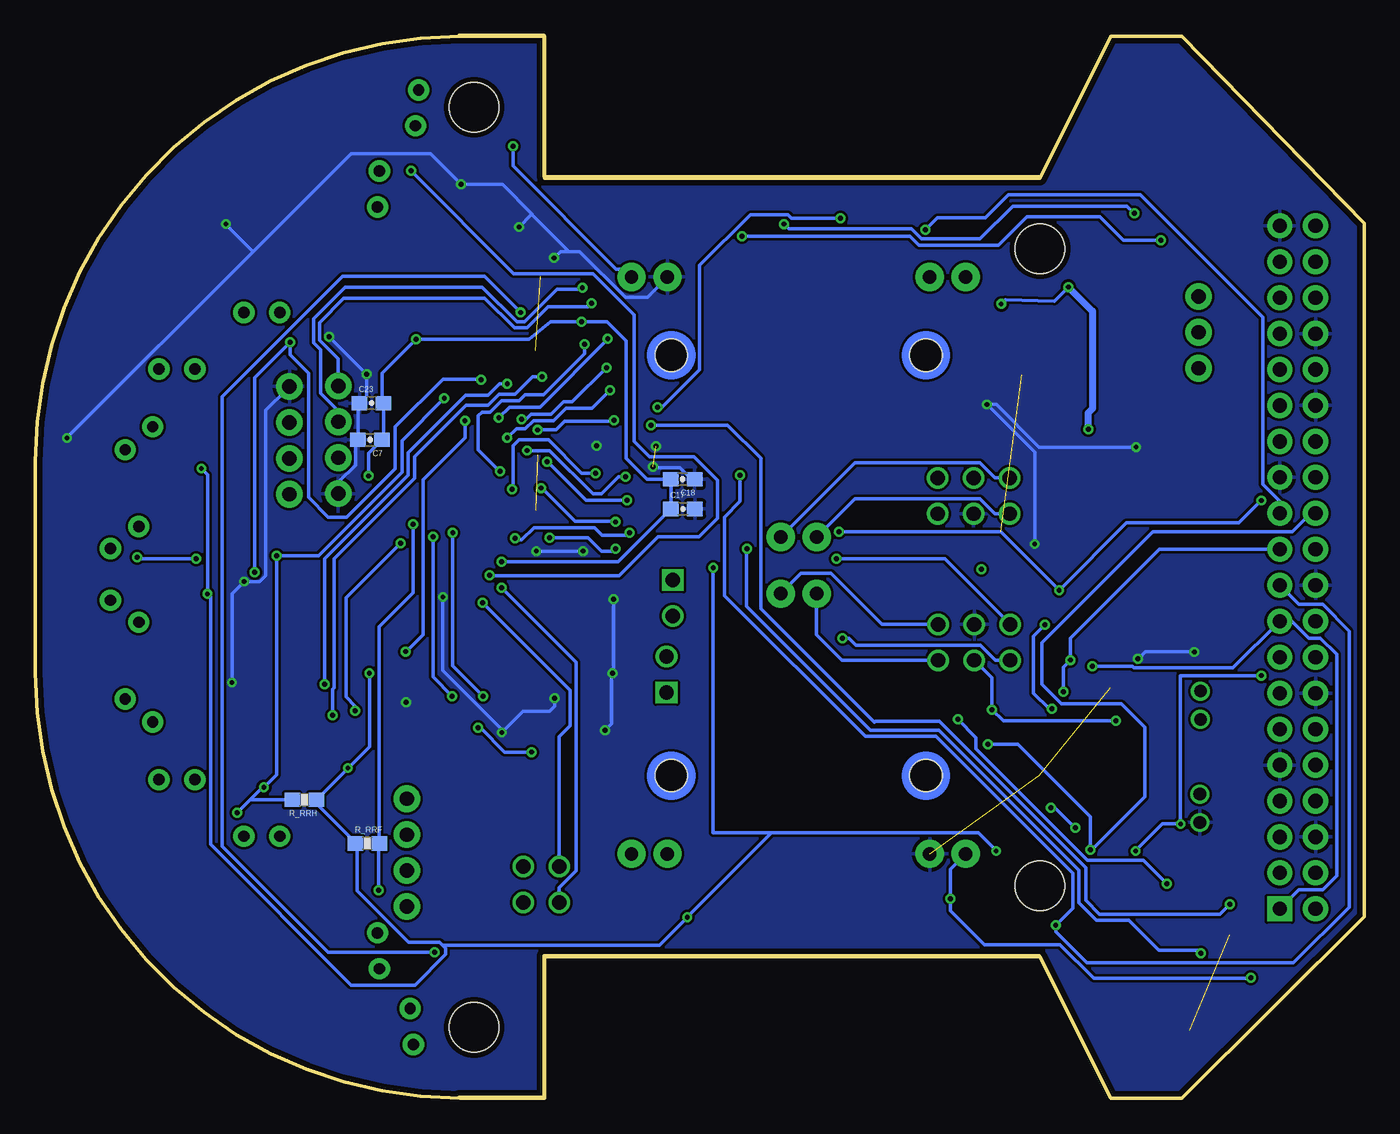
[diagram p8: board, bottom side, seen from below]

Size 93.9 x 75 mm. Coordinates in mm from the lower left corner, seen from the top.
Outline: 57.9,10 57.9,0 63.9,0 arc90 93.9,30 93.9,45 arc90 63.9,75 57.9,75 57.9,65 22.9,65 17.89,75 12.88,75 0,61.8 0,12.8 12.9,0 17.9,0 22.9,10 57.9,10
Copper layers (1*16): Top 0.0356mm / dielectric 1.5011mm / Bottom 0.0356mm
Design rules "LaenPCBOrder": minimum track width 6mil, minimum drill 13mil, track to track 6mil, track to pad 6mil, pad to pad 6mil, via to via 6mil, smd to smd 6mil, copper to edge 15mil, drill to drill 6mil, minimum pad ring 7mil, minimum via ring 7mil, stop-mask expansion 3mil, vias tented up to drill 0mil, thermal gap 10mil
Holes 3.5 mm at 22.9,15 62.9,5 62.9,70 22.9,60

### Footprints (pad centres in the part's own frame; a part is rotated, then mirrored left to right if it is on the bottom)
0603-CAP = smd 1.1 x 1: 1 -0.85,0; 2 0.85,0
1210 = smd 1.2 x 2: 1 -1.6,0; 2 1.6,0
LQFP-64 = smd 1.473 x 0.229: 1 -5.626,3.75; 2 -5.626,3.25; 3 -5.626,2.75; 4 -5.626,2.25; 5 -5.626,1.75; 6 -5.626,1.25; 7 -5.626,0.75; 8 -5.626,0.25; 9 -5.626,-0.25; 10 -5.626,-0.75; 11 -5.626,-1.25; 12 -5.626,-1.75; 13 -5.626,-2.25; 14 -5.626,-2.75; 15 -5.626,-3.25; 16 -5.626,-3.75; 33 5.626,-3.75; 34 5.626,-3.25; 35 5.626,-2.75; 36 5.626,-2.25; 37 5.626,-1.75; 38 5.626,-1.25; 39 5.626,-0.75; 40 5.626,-0.25; 41 5.626,0.25; 42 5.626,0.75; 43 5.626,1.25; 44 5.626,1.75; 45 5.626,2.25; 46 5.626,2.75; 47 5.626,3.25; 48 5.626,3.75 | smd 0.229 x 1.473: 17 -3.75,-5.626; 18 -3.25,-5.626; 19 -2.75,-5.626; 20 -2.25,-5.626; 21 -1.75,-5.626; 22 -1.25,-5.626; 23 -0.75,-5.626; 24 -0.25,-5.626; 25 0.25,-5.626; 26 0.75,-5.626; 27 1.25,-5.626; 28 1.75,-5.626; 29 2.25,-5.626; 30 2.75,-5.626; 31 3.25,-5.626; 32 3.75,-5.626; 49 3.75,5.626; 50 3.25,5.626; 51 2.75,5.626; 52 2.25,5.626; 53 1.75,5.626; 54 1.25,5.626; 55 0.75,5.626; 56 0.25,5.626; 57 -0.25,5.626; 58 -0.75,5.626; 59 -1.25,5.626; 60 -1.75,5.626; 61 -2.25,5.626; 62 -2.75,5.626; 63 -3.25,5.626; 64 -3.75,5.626
SOT23 = smd 1 x 1.4: 1 -0.95,-1.1; 2 0.95,-1.1; 3 0,1.1
SOT23-5 = smd 0.6 x 1.2: 1 -0.95,-1.306; 2 0,-1.306; 3 0.95,-1.306; 4 0.95,1.306; 5 -0.95,1.306
1X04 = drill 1.016 pad 1.88: 1 0,0; 2 2.54,0; 3 5.08,0; 4 7.62,0
HTSS-103-XX-XX-D = drill 1.016 pad 1.524: 1 -2.54,-1.27; 2 -2.54,1.27; 3 0,-1.27; 4 0,1.27; 5 2.54,-1.27; 6 2.54,1.27
HTSS-102-XX-XX-D = drill 1.016 pad 1.524: 1 -1.27,-1.27; 2 -1.27,1.27; 3 1.27,-1.27; 4 1.27,1.27
MOLEX-1X2 = drill 1.016 square: 1 0,0 | drill 1.016: 2 2.54,0
1007 = smd 2 x 0.8: 1 0,1; 2 0,-1
LED-1206 = smd 1.2 x 1.4: A -1.5,0; C 1.5,0
EMITTER = drill 0.8 pad 1.5: + -1.27,-0.5; - 1.27,-0.5
DMN3150LW = smd 0.7 x 0.9: D 0,0.95; G -0.65,-0.95; S 0.65,-0.95
M0805 = smd 1.3 x 1.6: 1 -0.95,0; 2 0.95,0
0805 = smd 0.8 x 1.2: 1 -0.9,0; 2 0.9,0
R0805 = smd 1.3 x 1.5: 1 -0.95,0; 2 0.95,0
0603-RES = smd 1.1 x 1: 1 -0.85,0; 2 0.85,0
RECEIVER = drill 0.8 pad 1.5: C 1.27,-0.5; E -1.27,-0.5
TACTILE_SWITCH_SMD_4.6X2.8MM = smd 0.9 x 1: 1 -2.05,-0.8; 2 2.05,-0.8; 3 2.05,0.8; 4 -2.05,0.8
SWITCH-SPDT = drill 1.016 pad 1.88: 1 0,2.54; 2 0,0; 3 0,-2.54
TESTPOINT_ROUND_2MM = smd 2 x 2: P$1 0,0
SOIC127P600X175-16N = smd 2.057 x 0.61: 1 -4.801,8.89; 2 -4.801,7.62; 3 -4.801,6.35; 4 -4.801,5.08; 5 -4.801,3.81; 6 -4.801,2.54; 7 -4.801,1.27; 8 -4.801,0; 9 0,0; 10 0,1.27; 11 0,2.54; 12 0,3.81; 13 0,5.08; 14 0,6.35; 15 0,7.62; 16 0,8.89
SOP65P640X120-17N = smd 1.57 x 0.41: 1 -2.87,2.275; 2 -2.87,1.625; 3 -2.87,0.975; 4 -2.87,0.325; 5 -2.87,-0.325; 6 -2.87,-0.975; 7 -2.87,-1.625; 8 -2.87,-2.275; 9 2.87,-2.275; 10 2.87,-1.625; 11 2.87,-0.975; 12 2.87,-0.325; 13 2.87,0.325; 14 2.87,0.975; 15 2.87,1.625; 16 2.87,2.275 | smd 2.105 x 3.115: 17 0,0
SOIC127P600X175-8N = smd 1.981 x 0.559: 1 -2.464,1.905; 2 -2.464,0.635; 3 -2.464,-0.635; 4 -2.464,-1.905; 5 2.464,-1.905; 6 2.464,-0.635; 7 2.464,0.635; 8 2.464,1.905
QFN-24-EP = smd 1.016 x 0.254: 1 -2.066,1.257; 2 -2.066,0.75; 3 -2.066,0.247; 4 -2.066,-0.287; 5 -2.066,-0.792; 6 -2.066,-1.297; 13 2.086,-1.297; 14 2.086,-0.792; 15 2.086,-0.287; 16 2.086,0.247; 17 2.086,0.75; 18 2.086,1.257 | smd 0.254 x 1.016: 7 -1.267,-2.122; 8 -0.762,-2.122; 9 -0.258,-2.122; 10 0.278,-2.122; 11 0.78,-2.122; 12 1.287,-2.122; 19 1.287,2.082; 20 0.78,2.082; 21 0.278,2.082; 22 -0.258,2.082; 23 -0.762,2.082; 24 -1.267,2.082 | smd 2.616 x 2.616: P$1 0.02,-0.01
JST_CONNECTOR_FEMALE = drill 0.889: + 0,1; - 0,-1
TPS73633(SOT-23) = smd 0.55 x 1: EN 0.95,-1.35; GND 0,-1.35; IN -0.95,-1.35; NR/FB 0.95,1.35; OUT -0.95,1.35
TPS76850(SOIC-8) = smd 0.55 x 1.5: EN(BAR) -0.635,-2.7; FB/NC -0.635,2.7; GND -1.905,-2.7; IN1 0.635,-2.7; IN2 1.905,-2.7; OUT1 0.635,2.7; OUT2 1.905,2.7; PG -1.905,2.7
MY_MM_MOTOR_MOUNT = drill 0.95 pad 2: L_CHA -20.375,26.73; L_CHB -20.375,24.19; L_GND -20.375,45.27; L_MOTOR_A -2,37.27; L_MOTOR_B -2,34.73; L_VCC -20.375,47.81; R_CHA 20.375,45.27; R_CHB 20.375,47.81; R_GND 20.375,26.73; R_MOTOR_A 2,34.73; R_MOTOR_B 2,37.27; R_VCC 20.375,24.19 | hole 2.286: 14.85,45; 14.85,27; -14.85,27; -14.85,45
RASPI_GPIO_B+_PIN = drill 1 pad 1.778 square: 1 -24.13,-1.27 | drill 1 pad 1.778: 2 -24.13,1.27; 3 -21.59,-1.27; 4 -21.59,1.27; 5 -19.05,-1.27; 6 -19.05,1.27; 7 -16.51,-1.27; 8 -16.51,1.27; 9 -13.97,-1.27; 10 -13.97,1.27; 11 -11.43,-1.27; 12 -11.43,1.27; 13 -8.89,-1.27; 14 -8.89,1.27; 15 -6.35,-1.27; 16 -6.35,1.27; 17 -3.81,-1.27; 18 -3.81,1.27; 19 -1.27,-1.27; 20 -1.27,1.27; 21 1.27,-1.27; 22 1.27,1.27; 23 3.81,-1.27; 24 3.81,1.27; 25 6.35,-1.27; 26 6.35,1.27; 27 8.89,-1.27; 28 8.89,1.27; 29 11.43,-1.27; 30 11.43,1.27; 31 13.97,-1.27; 32 13.97,1.27; 33 16.51,-1.27; 34 16.51,1.27; 35 19.05,-1.27; 36 19.05,1.27; 37 21.59,-1.27; 38 21.59,1.27; 39 24.13,-1.27; 40 24.13,1.27

### Placement (x,y rotation side)
C1  48.09,45.36 0 top
C2  58.6,57.55 270 top
C3  64.75,15.95 180 top
C4  60.75,57.55 270 top
C5  9.51,10.69 90 top
C6  67.2,25.26 270 top
C7  70.25,46.5 180 bottom
C8  47.95,47.55 0 top
C9  80.4,37.25 270 top
C12  16.29,58.64 90 top
C13  24.13,49.35 180 top
C15  64.87,25.21 270 top
C16  66.75,33.68 90 top
C17  48.14,41.62 0 bottom
C18  48.16,43.72 180 bottom
C20  19.35,22.1 90 top
C21  71.8,53.75 270 top
C22  69.55,53.8 90 top
C23  70.15,49.1 0 bottom
C_3.3V1  20.1,37 180 top
C_3.3V2  20.1,39.25 180 top
C_5V1  14.8,33 0 top
C_5V2  16.35,29 0 top
C_BAT1  11.25,39.45 180 top
C_BAT2  10.75,34.25 270 top
C_E_H1  78.28,10.4 90 top
C_E_H2  81.3,13.15 90 top
C_ELF1  77.8,66.55 270 top
C_ELF2  81.3,62.79 180 top
C_EM_D1  92.12,42.67 90 top
C_EM_D2  91.99,48.58 270 top
C_ERF1  88.84,22.48 180 top
C_ERF2  88.79,20.25 180 top
C_GY_CP  26.3,14.05 270 top
C_GY_REG  16.8,16.1 0 top
C_GY_VDD  15,18.75 270 top
C_NR  18.2,32.4 180 top
CR1  61.81,47.16 0 top
D1  62.35,22.6 270 top
IC1  24.25,22.8 270 top
J1  75.94,50.28 270 top
J2  67.65,21.15 270 top
J3  27.55,32.2 180 top
J4  72.5,42.7 90 top
J5  27.6,42.55 0 top
J6  58.15,15.1 0 top
JP1  48.85,36.6 270 top
JP3  49.3,28.65 90 top
L1  19.85,41.9 180 top
LED_PWR  15.45,49.6 90 top
LEFT_FRONT_EMITTER  67.42,70 275 top
NMOS1  64.33,66.62 0 top
NMOS2  83.04,30.12 270 top
NMOS3  62.86,8.78 90 top
NMOS4  79.32,24.68 270 top
R1  59.59,60.16 180 top
R2  58.84,27.19 90 top
R3  64.75,19.3 270 top
R8  55.31,30.95 0 top
R9  55.51,35.55 0 top
R_ED1  87.87,30.84 90 top
R_ED2  85.68,30.84 90 top
R_ED_PD  75.35,28.36 90 top
R_EH1  82.41,24.53 0 top
R_EH2  82.71,26.66 0 top
R_EH_PD  75.33,25.18 90 top
R_ELF  69.07,68.65 90 top
R_ELF_PD  62.24,62.66 0 top
R_ERF  59.77,7.14 270 top
R_ERF_PD  64.61,13.03 270 top
R_PWR  17.8,48.3 270 top
R_RLD  84.01,45.46 0 top
R_RLF  78.98,33.71 180 top
R_RLH  79.03,53.28 180 top
R_RRD  70.78,25.35 180 top
R_RRF  70.45,17.98 0 bottom
R_RRH  74.9,21.07 180 bottom
R_VM1  15.47,25.42 180 top
R_VM2  15.48,23.04 0 top
R_VM4  24,25.9 180 top
R_VM5  20.05,34.7 180 top
R_VM6  17.95,19.4 0 top
R_VM7  20.25,25.5 90 top
REC_LF  70.15,64.25 273 top
S1  14.46,5.5 0 top
S2  11.71,54.1 180 top
TP1  78.05,31 90 top
TP2  80.7,43.4 90 top
TP3  75.25,12.95 90 top
TP4  74.55,58.05 90 top
TP5  73.4,18.15 90 top
TP6  71.7,15.2 90 top
U1  74.84,31.04 0 top
U2  61.67,32.28 0 top
U3  21.72,53.01 0 top
U6  15.8,11.15 180 top
U$1  11.61,20.47 0 top
U$2  11.56,27.75 0 top
U$3  16.7,36.55 180 top
U$4  14.8,44.05 270 top
U$7  86.9,47 320 top
U$8  86.9,27 220 top
U$9  70.15,10.38 267 top
U$11  87.9,40 322 top
U$12  3.96,37.63 270 top
U$13  67.81,5.02 265 top
U$17  87.9,34 218 top
U$18  83.9,52 0 top
U$19  83.9,22 180 top
U$20  77.9,18 180 top
U$21  77.9,56 0 top
X1  4.7,37.5 90 top

### Tracks (layer width: path | path; a pad name or v marks a point on that pad's centre or on a via)
3.3V  (via drill 0.35)
  Top 0.254: 17.7,35.2 18.01,35.2 19,36.2 19.93,36.2 20.48,36.75 20.95,36.75 C_3.3V1.1 C_3.3V2.1 | 17.7,35.2 U$3.OUT | C_3.3V2.1 19.85,40.35 L1.1 | C_3.3V2.1 21.88,39.25 21.88,55.3 22.78,56.21 24.12,56.21 30.81,62.9 36.25,62.9 | 56.18,57.15 56.18,59.52 52.8,62.9 37.75,62.9 | 56.18,57.15 56.18,55.87 | 56.18,57.15 56.63,56.7 C2.2 | CR1.64 57.31,53.54 57.31,55.41 C2.2 | C4.2 C2.2 | J1.4 75.08,42.66 74.55,43.19 | 74.55,43.19 J4.2 | 74.55,43.19 74.55,51.87 73.52,52.9 C21.2 69.6,52.9 C22.1 | C22.1 69.47,52.95 CR1.48 | CR1.13 54.8,44.91 54.36,45.36 C1.2 48.8,45.5 C8.2 48.8,47.65 v49.95,48.8 | 56.18,55.87 v55.3,54.85 | v70.35,43.95 67.94,41.54 CR1.32 | v60.95,37.9 60.45,37.9 59.06,39.29 CR1.19 | v67,53.6 67.65,52.95 C22.1 | 37.75,62.9 36.25,62.9 | 17.7,35.2 17.7,34.4 18.55,33.55 19.6,33.55 20.05,33.09 20.05,31.62 19.2,30.77 v19.2,30.5 19.1,30.4 19.1,28.1 18.6,27.6 18.6,26.25 17.62,25.27 17.62,22.43 15,19.8 C_GY_VDD.1 14.07,18.67 14.07,16.75 12.35,15.04 12.35,14.31 13.71,12.95 U6.13 | 36.25,62.9 v37,62.15 37.75,62.9 | CR1.1 56.18,55.87
  Bottom 0.254: v60.95,37.9 52.71,37.9 C17.1 48.99,43.7 C18.2 50.67,43.72 52.15,45.2 52.15,53.5 53.5,54.85 v55.3,54.85 57.51,54.85 59.03,53.6 v67,53.6 69.4,51.2 69.4,49.2 C23.2 69.3,46.6 C7.1 70.35,45.55 v70.35,43.95 | v19.2,30.5 16.38,30.5 16.27,30.39 9.27,30.39 X1.17 5.12,33.69 3.92,32.5 3.09,32.5 1.95,31.36 1.95,15.7 2.94,14.72 4.62,14.72 X1.1 | v37,62.15 40.47,62.15 40.73,62.41 43.37,62.41 46.96,58.82 46.96,51.44 49.6,48.8 v49.95,48.8
5V  (via drill 0.35)
  Top 0.254: U$4.OUT2 17.65,41.99 | 66.81,72.69 66.8,72.7 | 88.62,57.49 88.65,57.49 | 92.12,41.78 C_EM_D1.1 90.59,40.29 90.59,40.39 | C_ELF1.1 78.86,68.45 79.2,68.45 | C_ELF2.1 82.15,65.25 82.28,65.38 | C_EM_D2.1 91.99,51.18 90.59,52.58 | C_ERF2.1 91.09,21.7 | 83.8,12.35 81.34,12.35 C_E_H2.1 | 81,9.55 C_E_H1.1 | 20.95,57.3 v20.9,57.3 20.81,57.32 19.16,57.79 C12.1 | v25.65,56.1 25.7,56.05 25.7,54.93 | 25.7,54.93 25.7,54.1 27.9,51.9 27.9,44.12 J5.4 | 25.7,54.93 24.2,54.93 U3.8 | U2.12 64.54,31.85 | 64.54,31.85 64.54,31.35 | 64.54,31.35 U2.11 | C6.1 65.92,27.38 | 65.92,27.38 65.85,27.46 65.85,30.7 65.2,31.35 64.54,31.35 | 65.92,27.38 64.87,26.32 C15.1 64.87,26.21 64.66,26.15 | C16.1 66.33,33.26 U2.14 64.4,33.12 63.69,33.12 63.45,32.88 63.45,32.33 63.69,32.09 64.29,32.09 64.54,31.85 | v86.7,38.2 86.7,40.28 U$11.+ | U1.16 75.39,39.38 77.07,39.38 78.35,38.1 C9.1 v82.55,38.1 | 16.55,26.9 16.75,26.9 17,26.65 v17.55,26.65 | 25.56,25.19 IC1.5 28.15,21.15 U$12.R_VCC | 25.56,25.19 R_VM4.1 | 25.56,25.19 25.56,26.71 v26.3,27.45 | v8,8.5 3.43,13.07 X1.2 X1.4 | v58.85,24.45 53.08,18.68 53.08,16.72 50.46,14.1 v29.25,14.1
  Top 0.305: 17.65,41.99 17.65,40.05 | 17.65,40.05 U$3.IN | 17.65,40.05 15.75,40.05 | 15.75,40.05 14.8,40.05 13.95,39.2 C_5V1.1 13.95,29.8 C_5V2.1 14.75,27.4 15.25,26.9 16.55,26.9 | U$4.OUT2 U$4.OUT1 | U$3.EN 15.75,40.05 | 64.66,26.15 v62.6,26.15 | 28.25,17.2 28.15,17.2 U$12.R_VCC | R2.1 58.85,26.27 v58.85,24.45
  Top 0.381: v19.5,47.25 18,47.25 R_PWR.2
  Top 0.483: v60.15,67.25 59,66.1
  Top 0.508: 30.58,64.15 58.25,64.15 59,64.9 59,66.1 59,70.85 60.85,72.7 66.8,72.7 67.5,72.7 77.68,69.97 79.2,68.45 82.28,65.38 87.34,60.31 88.65,57.49 90.59,53.34 90.59,52.58 90.59,40.39 | U$13.+ 77.78,6.33 81,9.55 83.8,12.35 91.09,19.64 91.09,21.7 91.09,23.88 | LEFT_FRONT_EMITTER.+ 66.81,72.69 | U$18.+ 88.62,57.49 | U$11.+ 90.59,40.39 | 90.59,40.39 91.09,39.89 91.09,23.88 | C_ERF1.1 91.09,23.88 | U$4.OUT1 18.23,43.41 19.5,44.69 v19.5,47.25
  Top 0.61: 30.58,64.15 23.68,57.25 20.89,57.25 20.81,57.32
  Bottom 0.254: v20.9,57.3 21.9,56.3 25.35,56.4 v25.65,56.1 | v82.55,38.1 86.6,38.1 v86.7,38.2 | v60.15,67.25 60.15,65.85 52.85,58.55 52.31,58.55 U$12.L_VCC | v17.55,26.65 25.5,26.65 v26.3,27.45 26.3,29.68 J3.4 | v8,8.5 8.04,8.46 19.11,8.46 21.5,10.85 26.85,10.85 29.25,13.25 v29.25,14.1 29.25,16.16 U$12.R_VCC | v58.85,24.45 60.75,24.45 62.45,26.15 v62.6,26.15
  Bottom 0.508: v19.5,47.25 19.5,48.4 19.2,48.7 19.2,55.6 v20.9,57.3
(USART1)_RX  (via drill 0.35)
  Top 0.254: CR1.42 72.37,47.91 J4.3 | v55.25,57.25 55.25,59.45 52.55,62.15 41.4,62.15 v41,61.75 | v16.25,62.5 15.01,61.26 15.01,60.33 12.57,57.89 11.19,57.89 8.1,54.79 8.1,23.97 6.46,22.34 4.78,22.34 X1.8
  Bottom 0.254: J4.3 72.5,48.56 73.75,49.8 73.75,52.85 74.24,53.35 74.24,55.06 72,57.3 62.33,57.3 59.87,54.84 59.33,54.84 57.02,57.15 55.35,57.15 v55.25,57.25 | v41,61.75 40.65,61.4 31.98,61.4 31.27,60.69 27.15,60.69 24.84,63.01 16.76,63.01 v16.25,62.5
(USART1)_TX  (via drill 0.35)
  Top 0.254: J4.4 70.59,48.41 CR1.43 | v54.6,56.15 54.28,56.47 54.28,59.23 52.61,60.9 v43.95,60.9 | v14.35,60.6 12.07,58.32 11.02,58.32 7.67,54.97 7.67,53.92 6.41,52.66 5.48,52.66 4.62,51.81 4.62,25.58 3.43,24.38 X1.10
  Bottom 0.254: J4.4 72.5,52.22 73.81,53.53 73.81,54.79 72.1,56.5 62.14,56.5 60.05,54.41 59.15,54.41 57.66,55.9 54.85,55.9 v54.6,56.15 | v43.95,60.9 32.09,60.9 31.45,60.26 25.83,60.26 23.84,62.26 18.66,62.26 17,60.6 v14.35,60.6
A3.3V
  Top 0.254: L1.2 21.35,44.4 21.35,55.7 22,56.35 22,56.4 22.24,56.64 23.94,56.64 30.65,63.35 58.3,63.35 61.55,66.6 73.15,66.6 | 73.15,66.6 74.4,66.6 81.55,59.45 81.55,56.9 | REC_LF.C 73.15,66.39 73.15,66.6 | U$21.C 80.15,55.5 81.55,56.9 | 81.55,56.9 81.55,51.09 84.09,48.55 86.15,48.55 87.55,47.15 U$7.C 84.67,42.92 84.67,32.37 83.05,30.75 83.05,29.45 83.15,29.35 | U$8.C 85.61,26.89 83.15,29.35 | 83.15,29.35 82.85,29.05 82.85,28.99 81.91,28.05 81.35,28.05 79.25,25.95 79.25,21.12 U$20.C 76.63,16.65 73.05,13.07 73.05,11.65 70.54,9.14 U$9.C
AGND  (via drill 0.33)  (1 unrouted)
  Top 0.254: U2.13 65.34,32.6 67.55,30.4 69.4,30.4 69.65,30.65 | 69.65,30.65 U1.8 | 13.66,9.84 U6.18 13.62,9.84 12.35,9.84 12.03,9.53 10.76,9.53 10.76,10.16 10.44,10.48 10.44,16.83 v12.98,19.37 12.98,21.27 14.57,22.86 R_VM2.1 | U6.1 18.67,9.89 18.7,9.84 20.6,11.75 20.6,16.19 21.87,17.46 v26,17.46 | v71.81,23.32 71.81,25.26 R_RRD.1 | v70.3,30.01 69.65,30.65 | 69.65,30.66 69.65,30.65 | v81.74,35.62 80.01,33.9 R_RLF.1 | v82.17,44.48 83.03,45.34 R_RLD.1 83.03,45.55 80.01,48.58 80.01,53.11 R_RLH.1 | v47.83,12.77 47.4,13.2 C_GY_CP.2 | U6.11 15.02,17.88 C_GY_VDD.2 15.2,17.78 15.84,17.78 v16.16,17.46 17.43,16.19 C_GY_REG.2 | v21.55,35.88 20.28,35.88 19.33,34.92 R_VM5.2 | v37.11,40.01 38.06,40.96 42.82,40.96 42.82,38.42 43.78,37.47 v46,37.47 | v7.27,42.23 v7.27,29.84
  Bottom 0.254: v70.3,30.01 70.3,24.83 v71.81,23.32 73.97,21.16 R_RRH.1 74.18,20.94 71.38,18.14 R_RRF.1 71.16,17.92 71.16,14.65 67.52,11.01 65.33,11.01 65.11,10.79 | v82.17,44.48 81.74,44.04 v81.74,35.62 81.52,35.41 81.52,17.92 71.59,7.99 67.06,7.99 64.9,10.15 64.9,10.58 65.11,10.79 | 65.11,10.79 49.8,10.79 v47.83,12.77 47.59,13.02 41.87,18.73 | v16.16,17.46 14.25,19.37 v12.98,19.37 12.98,29.84 v7.27,29.84 | v26,17.46 27.27,18.73 41.87,18.73 | v37.11,40.01 25.68,40.01 v21.55,35.88 16.79,40.64 8.85,40.64 v7.27,42.23 | v46,37.47 46,18.73 41.87,18.73
BATT_CONN
  Top 0.254: 11.56,21.52 U$1.+
  Top 1.016: U$2.- 11.56,21.52
CURRENT_SENSE  (via drill 0.35)
  Top 0.254: CR1.20 59.64,41.46 59.64,40.67 60,40.31 v60,39.55 | v20.4,19.1 20.1,19.4 R_VM6.2 18.8,20.7 C20.1 | v22.15,20.5 24.21,20.5 IC1.4 26.85,20.56 26.85,16.32 27.77,15.39 31.17,15.39 32.9,17.12 32.9,21.05 35.85,24 35.85,40.9 36.6,41.65 43.5,41.65 45.2,39.95 v51.9,39.95
  Bottom 0.254: v60,39.55 59.9,39.45 59.53,39.45 58.67,40.31 54.4,40.31 53.84,39.75 52.1,39.75 v51.9,39.95 | v20.4,19.1 20.45,19.1 21.85,20.5 v22.15,20.5
D2_EM
  Top 0.254: 86.57,33.63 U$17.- 87.87,32.33 R_ED1.2 R_ED2.2
D_EM
  Top 0.254: U$11.- U$17.+
EM_D  (via drill 0.35)
  Top 0.254: NMOS2.G 80.47,30.77 78.91,29.21 R_ED_PD.2 75.26,29.36 73.53,29.36 v73.45,29.25 | v60.55,50.45 v60.56,50.46 CR1.59
  Bottom 0.254: v73.45,29.25 73.45,38.1 67.55,44 67.55,45.6 63.5,49.65 61.9,49.65 61.1,50.45 v60.55,50.45
EM_H  (via drill 0.35)
  Top 0.254: NMOS4.G 76.77,25.33 76.05,26.05 75.35,26.05 R_EH_PD.2 73.92,26.03 v72.9,27.05 | v58.1,50.95 59.06,51.91 CR1.62
  Bottom 0.254: v72.9,27.05 72.9,28.87 72.79,28.98 72.79,38.11 67.12,43.78 67.12,45.3 63.47,48.95 61.9,48.95 61.14,49.71 60,49.71 58.76,50.95 v58.1,50.95
EM_LF
  Top 0.254: CR1.58 61.06,53.85 63.08,55.87 63.08,62.6 R_ELF_PD.2
  Top 0.508: R_ELF_PD.2 62.99,62.76 62.99,64.98 NMOS1.G
EM_RF  (via drill 0.35)
  Top 0.254: CR1.61 59.49,52.86 59.49,55.39 v59.6,55.5 | NMOS3.G 65.7,10.02 v65.7,10.3 65.7,11.09 R_ERF_PD.2
  Bottom 0.254: v65.7,10.3 73.2,10.3 80.7,17.8 80.7,49.53 72.18,58.05 62.15,58.05 v59.6,55.5
ENC_LA  (via drill 0.35)
  Top 0.254: U$12.L_CHA 29.06,56.38 29.06,51.05 30.14,49.97 J5.6 41.56,55.24 51.86,55.24 v53.45,53.65 | CR1.40 63.29,46.91 62.15,48.05 v61.15,48.05
  Bottom 0.254: v61.15,48.05 60.4,48.8 58.25,48.8 53.45,53.6 v53.45,53.65
ENC_LB  (via drill 0.35)
  Top 0.254: U$12.L_CHB 28.4,57.76 28.4,50.35 29.03,49.72 29.03,43.12 30.14,42.01 J5.5 39.44,50.58 52.53,50.58 v53.55,51.6 | CR1.39 63.14,46.41 62.16,47.39 60.63,47.39 60.07,47.95 v59.55,47.95
  Bottom 0.254: v59.55,47.95 59.23,47.95 58.88,48.3 57.45,48.3 56.57,49.18 55.97,49.18 v53.55,51.6
ENC_RA  (via drill 0.35)
  Top 0.254: U$12.R_CHA 49.1,17.26 36.85,29.51 v36.85,32.5 | CR1.37 62.4,45.41 61.93,45.88 60.27,45.88 58.95,47.2 v58.4,47.2 | v53,47.9 52.6,47.9 50.95,49.55 41.55,49.55 26.28,34.28 26.28,32.63 25.01,31.36 J3.6
  Bottom 0.254: J3.6 26.04,30.93 27.11,32 35.9,32 36.4,32.5 v36.85,32.5 | v58.4,47.2 57.1,47.2 56.5,47.8 53.1,47.8 v53,47.9
ENC_RB  (via drill 0.35)
  Top 0.254: U$12.R_CHB 37.3,31.73 37.3,32.02 37.51,32.23 37.51,32.77 37.3,32.98 v37.3,38.1 | CR1.38 62.79,45.91 62.05,46.65 v60.55,46.65 | v53.3,50 41.35,50 25.01,33.66 J3.5
  Bottom 0.254: J3.5 29.64,38.1 v37.3,38.1 | v60.55,46.65 59.91,47.29 59.28,47.29 58.7,47.87 57.27,47.87 56.39,48.75 54.55,48.75 v53.3,50
GND  (via drill 0.33, 0.35)  (6 unrouted)
  Top 0.254: C_5V2.2 17.95,30.9 17.73,31.12 | 17.73,31.12 17.2,31.65 17.2,32.25 C_NR.2 | 17.73,31.12 17.73,31.05 v16,31.05 16,33 C_5V1.2 15.46,33.03 15.03,33.47 15.03,35.84 16.75,37.57 | 65.11,24.4 67.06,24.4 C6.2 67.53,24.41 68.5,25.39 68.5,27.19 67.74,27.95 v67.7,27.95 | 65.11,24.4 64.9,24.4 C15.2 | 62.31,23.75 64.25,23.75 64.68,24.18 C15.2 | 62.31,23.75 61.44,23.75 D1.1 61.28,23.58 61.28,25.29 60.93,25.64 v60.93,25.84 | C3.2 61.93,17.92 61.93,20.56 62.31,20.94 62.31,23.75 | C_ERF1.2 88,22.45 88,20.3 C_ERF2.2 87.78,20.08 87.35,20.08 81.31,14.03 C_E_H2.2 81.09,13.82 78.72,11.44 78.28,11.44 C_E_H1.2 78.07,11.23 73.97,7.12 69,7.12 68.14,7.98 | NMOS4.S 78.28,24.18 75.48,24.18 R_EH_PD.1 75.26,24.4 74.61,24.4 72.24,26.77 72.24,27.42 72.67,27.85 75.05,27.85 75.26,27.64 R_ED_PD.1 75.48,27.64 78.07,27.64 79.8,29.36 v80.01,29.36 81.95,29.36 NMOS2.S | C22.2 69.65,54.62 71.59,54.62 C21.1 71.8,54.49 | v79.15,36.49 80.23,36.49 C9.2 | 71.81,54.41 71.8,54.49 | J1.1 75.91,50.3 75.91,51.17 73.28,53.8 v73.15,53.8 72.5,53.8 71.8,54.49 | C_BAT1.2 10.28,39.29 10.28,37.57 9.41,36.7 9.41,34.11 10.71,32.82 C_BAT2.2 10.92,32.6 v12,31.52 | 58.51,59.89 58.64,60.02 R1.2 | 58.51,59.89 58.25,59.64 | C4.1 60.66,58.08 58.2,58.08 58.2,58.11 58.25,58.15 C2.1 58.51,58.49 58.51,59.89 | 59.72,61.32 59.93,61.32 61.23,62.61 R_ELF_PD.1 | 59.72,61.32 58.64,60.24 R1.2 | 16.09,59.3 C12.2 | C_ELF1.2 77.64,65.63 80.44,62.83 C_ELF2.2 80.44,62.61 v80.44,61.75 | 16.75,37.57 16.75,37.78 U$3.GND 16.75,37.57 | 16.75,37.57 17.4,36.92 19.13,36.92 C_3.3V1.2 19.34,37.13 19.34,39.08 C_3.3V2.2 | 92.1,46.63 92.1,47.71 C_EM_D2.2
  Top 0.254: 92.1,46.63 92.1,43.61 C_EM_D1.2 | 12.57,4.8 S1.1 12.35,4.8 | 16.45,4.8 S1.2 | U$4.EN(BAR) 12,44.69 12,45.77 U$4.GND 12.22,45.99 v16.1,45.99 | C8.1 47.19,47.5 47.19,45.55 C1.1 48.1,44.5 50.15,44.5 v50.25,44.6 | v63.82,64.55 64.9,65.63 NMOS1.S | v65.11,35.41 65.98,34.54 66.62,34.54 C16.2 | R8.1 54.32,30.87 53.24,29.79 v53.1,30 | v53.05,35.25 v53.06,35.25 53.44,35.55 R9.1 55.2,36.13 v55.2,38.65 | CR1.31 65.11,41.67 65.11,42.53 65.55,42.96 68.35,42.96 70.08,44.69 70.73,44.69 72.67,42.75 J4.1 | 49.14,57.86 U$12.L_GND | v91.67,46.63 92.1,46.63 | v59.72,61.53 59.72,61.32 | CR1.47 67.5,50.48 68.29,50.48 68.95,51.15 v70.5,51.15 | R1.2 57.83,59.35 v57.25,59.35 | v58.5,38.65 58.5,41.48 CR1.18 | v50.05,46.05 54.2,46.05 v54.25,46.1 54.89,45.46 56.13,45.46 CR1.12 57.28,45.41 57.48,45.61 58.02,45.61 58.18,45.45 58.4,45.45 58.42,45.43 | 65.11,24.4 C15.2 | v53.65,26 55.9,28.25 v57.2,28.25 | J5.3 27.59,41.27 27.59,41.41
  Bottom 0.254: J1.1 76.12,50.09 77.64,48.58 77.64,36.92 78.07,36.49 v79.15,36.49 80.01,35.62 v80.01,29.36 | 56.2,59.8 58.82,62.43 | U$12.L_GND 49.35,57.86 50.65,56.57 52.2,56.57 55.45,59.8 56.2,59.8 | v65.11,35.41 65.11,30.23 60.93,26.04 v60.93,25.84 59.43,27.34 57.55,27.34 57.2,27.68 v57.2,28.25 | 53.24,29.79 53.19,29.86 | 53.19,29.86 v53.1,30 53.05,30.05 v53.05,35.25 | v23.28,39.14 23.28,45.63 v26.65,49 26,49 22.99,45.99 v16.1,45.99 | 78.5,59.8 71.59,66.71 65.98,66.71 v63.82,64.55 60.89,64.55 58.79,62.45 58.82,62.43 | 78.5,59.8 v91.67,46.63 | 78.5,59.8 v80.44,61.75 | 58.82,62.43 v59.72,61.53 | v12,31.52 15.46,31.52 15.89,31.09 v16,31.05 | 72.45,42.75 J4.1 | 72.37,42.83 72.45,42.75 | C23.1 71.1,49 C7.2 71.25,46.34 71.25,44.72 72.45,43.53 72.45,42.75 | C23.1 70.5,49.6 v70.5,51.15 v73.15,53.8 | v57.25,59.35 56.8,59.8 56.2,59.8 | v50.25,44.6 50.17,44.52 48.33,44.52 47.53,43.72 C18.1 | v55.2,38.65 v58.5,38.65 | v53.65,26 53.19,26.46 53.19,29.86 | 71.08,48.9 C23.1
  pour Top: 12.9,0 0.05,12.85 0.05,62.12 12.88,75 17.89,75 22.9,65 57.9,65 57.9,75 63.9,75 arc-90 93.9,45 93.9,30 arc-90 63.9,0 57.9,0 57.9,10 22.9,10 17.9,0
  pour Bottom: 0.05,62.12 0.05,12.85 12.9,0 17.9,0 22.9,10 57.9,10 57.9,0 63.9,0 arc90 93.9,30 93.9,45 arc90 63.9,75 57.9,75 57.9,65 22.9,65 17.89,75 12.88,75
H2_EM
  Top 0.254: U$19.- 82.63,23.89 R_EH1.2 83.26,26.36 R_EH2.2
H_EM
  Top 0.254: U$18.- 87.14,49.53 | 87.3,49.37 87.14,49.53 | U$19.+ 86.1,22.5 89.3,25.7 89.3,32.95 85.4,36.85 85.4,40.8 89.85,45.25 89.85,46.8 87.14,49.52 87.14,49.53
INT  (via drill 0.35)
  Top 0.254: 64.14,41.46 CR1.29 63.98,41.62 63.98,42.4 63.65,42.73 61.84,42.73 61.67,42.9 60.3,42.9 v60.2,43 | v54.3,44.15 53.35,43.2 35.85,43.2 34.3,41.65 34.3,28.15 32.9,26.75 v28.7,26.75 | U6.12 13.7,14.09 13.7,14.9 v13.95,15.15
  Bottom 0.254: v54.3,44.15 55.29,44.15 57.65,46.51 59.72,46.51 60.15,46.08 60.15,43.05 v60.2,43 | v13.95,15.15 15.6,16.8 19.55,16.8 27.42,24.68 27.42,25.48 v28.7,26.75
LEFT_MOTOR_H
  Top 0.254: U2.2 53.45,33.91 50.75,36.6 JP1.1 43.72,36.6 41.23,39.09 U$12.L_MOTOR_A
  Bottom 0.254: J5.2 26.09,43.82 27.16,44.89 35.98,44.89 U$12.L_MOTOR_A
LEFT_MOTOR_L
  Top 0.254: U2.4 53.74,32.6 52.29,34.06 JP1.2 45.24,34.06 41.65,37.65 40.68,37.65 U$12.L_MOTOR_B
  Bottom 0.254: J5.1 26.09,41.28 27.16,42.35 35.98,42.35 U$12.L_MOTOR_B
LF_EM
  Top 0.508: LEFT_FRONT_EMITTER.- 67.85,69.5 R_ELF.2
MUX_EN  (via drill 0.35)
  Top 0.254: 67.52,48.99 CR1.44 67.37,48.84 65.99,48.84 64.99,47.85 v63.55,47.85 | U1.7 69.93,32.2 68.25,32.2 67.75,31.7 v67.75,31.55
  Bottom 0.254: v63.55,47.85 63.55,46.65 66.5,43.7 66.5,32.75 67.7,31.55 v67.75,31.55
N$1
  Top 0.254: 24.38,52.17 U3.6 25.01,52.37 25.48,51.91 25.48,49.59 25.23,49.35 C13.1
N$2
  Top 0.254: U1.5 70.7,34.19 71.19,34.19 71.75,33.63 71.75,29.55 69,26.8 69,24.1 67.95,23.05 63.9,23.05 D1.3 64.75,21.3 R3.1
N$3  (via drill 0.35)
  other vias: 27.05,37.35
N$5
  Top 0.254: R_ERF.1 60.56,8.78 NMOS3.D
N$7
  Top 0.254: R_ELF.1 68.75,67.47
  Top 0.508: 68.75,67.47 64.43,67.47 NMOS1.D
N$9
  Top 0.254: R1.1 60.84,60.16 62.25,58.75 62.25,55.95 60.06,53.76 CR1.60
N$12
  Top 0.254: R2.2 58.8,28.13 U2.8
N$15
  Top 0.254: 58.7,33.26 U2.3 58.94,33.4 59.65,33.4 59.89,33.63 59.89,34.83 59.17,35.55 R9.2
N$18
  Top 0.254: R_ED1.1 R_ED2.1 84.11,29.99 NMOS2.D
N$19
  Top 0.254: R_EH2.1 81.56,26.36 R_EH1.1 80.42,24.53 NMOS4.D
N$20
  Top 0.254: U2.6 56.57,31.3 R8.2
N$21  (via drill 0.35)
  Top 0.254: 22.4,23.75 IC1.1 22.94,25.69 R_VM4.2 22.05,27 v22.05,27.5 | v22.55,33.45 21.3,34.7 R_VM5.1
  Bottom 0.254: v22.55,33.45 23.36,32.64 23.36,28.61 22.25,27.5 v22.05,27.5
N$24
  Top 0.254: U3.7 23.33,53.64 22.33,52.64 22.33,35.5 23.4,34.43 23.4,31.97 20.25,28.82 R_VM7.2
N$26
  Top 0.254: U$3.NR/FB 15.75,34.85 17.25,33.35 18.05,33.35 19,32.4 C_NR.1
N$27
  Top 0.254: R_PWR.1 16.5,49.15 LED_PWR.A
N$28
  Top 0.254: U6.10 15.52,15.67 C_GY_REG.1
N$29
  Top 0.254: 14.96,8.97 U6.20 15.02,8.58 15.89,7.71 19.11,7.71 C_GY_CP.1
N$31
  Top 0.254: IC1.3 21.84,21.85 21.45,21.45 21.45,21.36 | 21.45,21.36 21.42,21.33 19.95,22.8 19.5,22.8 C20.2 20.25,23.85 R_VM7.1 | 21.45,21.36 21.45,18.93 20.77,18.24 17.83,18.24 17.1,18.97 R_VM6.1
NRST  (via drill 0.35)
  Top 0.254: 16.31,6.3 S1.3 S1.4 | 12.41,6.51 S1.4 | S1.4 12.41,6.56 | v50.4,47.55 51.4,46.55 53.24,46.55 54.53,47.84 56.12,47.84 CR1.7 | S1.4 12.41,7.2 9.77,9.84 C5.1 7.95,11.4 7.95,12.15 v9.5,13.7
  Bottom 0.254: v50.4,47.55 45,47.55 42.64,45.19 42.64,34.59 34.6,26.55 34.52,26.62 30.02,26.62 19.68,16.27 19.68,13.97 18.71,13.01 10.19,13.01 v9.5,13.7
PWM_MOTOR_1  (via drill 0.35)
  Top 0.254: U2.16 63.09,36 60.07,36 | CR1.15 56.97,43.91 57.25,43.63 57.25,43.05 56.4,42.2 56.4,39.67 60.07,36 | v60.95,36.05 60.95,36 60.51,35.56 60.07,36
  Bottom 0.254: J6.1 56.88,14.86 55.68,16.06 55.68,30.78 v60.95,36.05
PWM_MOTOR_2  (via drill 0.35)
  Top 0.254: CR1.16 56.13,43.41 55.95,43.23 55.95,39.45 61.16,34.24 62.2,34.24 | 62.2,34.24 63.25,34.24 63.58,33.91 U2.15 | 62.2,34.24 62.2,34.9 v62.3,35
  Bottom 0.254: J6.2 56.88,25.54 56.12,26.31 56.12,28.82 v62.3,35
PWM_MOTOR_3  (via drill 0.35)
  Top 0.254: CR1.26 62.56,40.62 64.08,39.1 65.45,39.1 65.8,39.45 v65.8,39.65 | U2.9 64.45,29.92 v64.45,28.4 62.86,26.81 60.68,26.81 60.2,26.32 60.2,17.72 61.15,16.77 61.15,15.56 J6.3
  Bottom 0.254: v65.8,39.65 65.8,29.75 v64.45,28.4
PWM_MOTOR_4  (via drill 0.35)
  Top 0.254: 65.15,30.7 64.58,30.7 U2.10 64.4,30.52 63.69,30.52 63.45,30.28 63.45,29.57 62.28,28.4 v62.25,28.4 61.09,27.24 60.45,27.24 59.74,26.53 59.74,16.69 J6.4 | CR1.27 63.06,40.73 63.84,39.95 v64.4,39.95
  Bottom 0.254: v64.4,39.95 64.4,30.55 v62.25,28.4
REC_LD
  Top 0.254: CR1.23 61.13,41.47 61.13,40.22 63.95,37.39 U1.3 70.94,37.39 71.5,37.95 71.5,39.75 72.45,40.7 76.36,40.7 77.26,39.8 82.75,39.8 82.8,39.85 82.8,41.8 | U$7.E 85.61,46.2 R_RLD.2 84.86,43.86 82.8,41.8 | 82.8,41.8 82.3,41.8 TP2.P$1
REC_LF  (via drill 0.35)
  Top 0.254: CR1.22 60.63,41.47 60.63,40.05 62.3,38.38 62.3,37.93 | 62.3,37.93 64.11,36.12 U1.4 73.07,36.12 73.68,35.51 76.33,35.51 R_RLF.2 78.05,33.63 TP1.P$1 | REC_LF.E v67.35,65.5 | 62.3,37.93 62.3,37.45 v61.8,36.95
  Bottom 0.254: v67.35,65.5 60.1,58.25 54.5,58.25 51.6,55.35 51.6,46.4 50.5,45.3 47.35,45.3 45.7,43.65 45.7,40.95 47,39.65 49.9,39.65 52.65,36.9 61.75,36.9 v61.8,36.95
REC_LH  (via drill 0.35)
  Top 0.254: v78.4,37.15 75.08,37.15 U1.14 | R_RLH.2 76.02,53.28 v75.9,53.4 76.63,54.13 U$21.E 74.55,57.58 TP4.P$1 | v62.4,50.75 61.05,49.4 59,49.4 57.01,47.41 CR1.8
  Bottom 0.254: v78.4,37.15 78.4,50.9 v75.9,53.4 75.9,52.5 74.6,51.2 74.6,42.44 73.21,41.05 71.9,41.05 68.48,44.48 68.48,47.42 65.1,50.8 62.45,50.8 v62.4,50.75
REC_RD  (via drill 0.35)
  Top 0.254: U$8.E 87.55,26.6 83.95,23 83.95,18.7 72.9,7.65 69.1,7.65 67.88,8.88 | 67.88,8.88 67.8,8.95 | CR1.24 61.63,41.47 61.63,40.33 63.8,38.16 69.53,38.16 U1.2 68.64,38.66 v68.1,39.2 | 67.88,8.88 67.88,9.68 68.55,10.35 70.4,10.35 72.62,12.57 72.62,13.25 73.4,14.03 TP5.P$1 73.4,19.25 69.95,22.7 69.95,25.33 R_RRD.2 69.93,25.98 v71.3,27.35
  Bottom 0.254: v68.1,39.2 71.95,35.35 71.95,28.35 71.3,27.7 v71.3,27.35
REC_RF  (via drill 0.35)
  Top 0.254: CR1.25 62.09,41.51 62.09,40.47 63.94,38.63 66.19,38.63 67.48,39.93 | 67.48,39.93 U1.1 | U$9.E 69.67,11.72 69.67,13.93 69.65,13.95 v69.65,14.7 69.86,14.9 70.08,15.11 71.59,15.11 TP6.P$1 | 67.23,40.58 v67.2,40.55 67.48,40.27 67.48,39.93
  Bottom 0.254: 69.6,18.13 | 69.6,18.13 R_RRF.2 69.65,17.93 v69.65,14.7 | v67.2,40.55 67.2,35.7 69.6,33.3 69.6,18.13
REC_RH  (via drill 0.35)
  Top 0.254: v79.65,20.15 79.17,19.67 U$20.E 75.25,14.58 TP3.P$1 | v76.85,38.3 76.49,38.66 U1.15 | CR1.9 57.16,46.91 59.1,48.85 61.55,48.85 62.8,50.1 64.7,50.1 65,49.8 v65,49.45
  Bottom 0.254: v79.65,20.15 78.73,21.07 | 78.73,21.07 R_RRH.2 | 78.73,21.07 77.85,21.95 v77.75,21.95 76.85,22.85 v76.85,38.3 73.9,38.3 68,44.2 68,46.45 v65,49.45
RF_EM
  Top 0.254: U$13.- 66.19,3.79 64.94,2.54 61.77,2.54 59.74,4.57 59.74,6.26 R_ERF.2
RIGHT_MOTOR_H
  Top 0.254: U$12.R_MOTOR_A 45.68,28.65 JP3.1 55.5,28.65 57.5,30.66 U2.7
  Bottom 0.254: J3.2 36.89,30.93 38.69,32.73 U$12.R_MOTOR_A
RIGHT_MOTOR_L
  Top 0.254: U$12.R_MOTOR_B 45.68,31.19 JP3.2 50.06,31.95 U2.5
  Bottom 0.254: U$12.R_MOTOR_B 39.8,37.07 37.69,37.07 34.09,33.47 J3.1
SENSOR_DEBUG
  Top 0.254: J2.4 67.65,13.9 C3.1 65.6,17.5 R3.2
SPI2_MISO  (via drill 0.35)
  Top 0.254: CR1.35 66.56,44.41 66.55,44.4 62.1,44.4 61.5,45 57.8,45 v57.75,44.95 | v52.1,42.25 51.65,42.7 36.05,42.7 34.73,41.38 34.73,27.97 33.08,26.32 32.82,26.32 32.05,25.55 28,25.55 27.45,26.1 27.45,27.55 26.3,28.7 v21.25,28.7 | U6.9 16.06,13.97 16.98,14.89 18.53,14.89 18.86,15.22 18.86,17.03 18.23,17.66 16.98,17.66 16.25,18.39 16.25,20.33 18.06,22.14 18.06,25.01 19.05,26 19.05,27.44 19.55,27.93 19.55,29.75 v20.75,30.95 20.8,30.95
  Bottom 0.254: v57.75,44.95 57.7,44.95 55,42.25 v52.1,42.25 | X1.21 14.48,38.77 20.75,32.5 v20.75,30.95 21.25,30.45 v21.25,28.7
SPI2_MOSI  (via drill 0.35)
  Top 0.254: CR1.36 66.01,44.91 65.95,44.85 62.35,44.85 61.75,45.45 59.45,45.45 v59.15,45.75 | v52.2,43.9 44.05,43.9 44.1,43.95 v44.1,44 | U6.24 17.82,8.32 19.02,8.32 21.8,11.1 v21.8,12.2
  Bottom 0.254: v59.15,45.75 57.55,45.75 54.5,42.7 53.9,42.7 52.7,43.9 v52.2,43.9 | v44.1,44 44.1,42.15 45.2,41.05 45.2,35.5 35.25,25.55 30.25,25.55 20.6,15.9 20.6,13.4 v21.8,12.2 21.8,11.95 21.78,11.93 21.78,11.75 19.58,9.55 5,9.55 1.05,13.5 1.05,33 2.94,34.88 4.62,34.88 X1.19
SPI2_NSS  (via drill 0.35)
  Top 0.254: v52.9,40.7 52.4,41.2 51.9,41.2 51,42.1 36.2,42.1 35.25,41.15 35.25,27.8 32.4,24.95 26.65,24.95 v26.6,25 | CR1.33 67.39,43.46 60.87,43.46 60.36,43.97 59.87,43.97 59,43.1 v58.15,43.1 | 16.56,13.76 U6.8 16.56,13.81 17.05,14.3 18.9,14.3 19.4,14.8 19.4,17.5 v19.35,17.55
  Bottom 0.254: v58.15,43.1 58.1,43.1 55.75,40.75 52.95,40.75 v52.9,40.7 | X1.24 3.78,41.31 5.08,40.02 14.92,40.02 22.77,32.16 22.77,29.23 21.4,27.85 17.15,27.85 15.5,26.2 15.5,21.3 19.25,17.55 v19.35,17.55 19.35,19.88 24.47,25 v26.6,25
SPI2_SCK  (via drill 0.35)
  Top 0.254: CR1.34 67.38,43.97 61.34,43.97 61.34,44.01 v61.05,44.3 | v55.1,53.25 55.1,53.65 53.7,55.05 53.7,58.7 52.45,59.95 32.4,59.95 v31,61.35
  Bottom 0.254: v55.1,53.25 55.1,52.6 58,49.7 59.3,49.7 59.72,49.28 60.96,49.28 61.77,48.47 62.33,48.47 62.6,48.2 62.6,45.8 61.1,44.3 v61.05,44.3 | v31,61.35 30.15,62.2 26.75,62.2 25.15,63.8 15.8,63.8 7.16,55.16 7.16,43.36 5.97,42.16 X1.23
SWCLK
  Top 0.254: J1.2 77.39,49.19 77.39,50.74 72.38,55.75 67.52,55.75 65.56,53.79 CR1.49
V_BATT
  Top 0.254: 11.04,43.55 11.19,43.41 | U3.4 18.41,51.1 18.4,51.1 | S2.2 11.76,54.15
  Top 0.61: S2.2 10.15,52.54 10.15,44.45 11.04,43.55 | 11.19,43.41 U$4.IN1 U$4.IN2 C_BAT1.1 12.1,37.2 | C_BAT2.1 12.1,37.2 | 18.4,51.1 15.35,54.15 11.76,54.15 | R_VM1.2 12.85,27.18 12.85,36.45 12.1,37.2 | U3.4 20.4,51.11 20.73,51.44 20.73,53.2 20.29,53.64 U3.2
V_BATT_POWER
  Top 0.254: S2.3 11.66,56.59 | U3.3 19.01,52.12
  Top 0.61: 11.66,56.59 8.75,53.68 8.75,31.57 U$2.+ | 16.61,54.11 17.38,54.89 19.23,54.89 U3.1 | S2.3 14.07,56.64 16.61,54.11 | U3.3 18.34,52.37 16.61,54.11
VBAT_SENSE  (via drill 0.35)
  Top 0.254: v43.6,38.8 v52.9,38.8 | 16.32,25.26 R_VM1.1 | 16.32,23.1 R_VM2.2 16.43,22.94 13.63,20.14 13.63,16.93 10.95,14.25 10.95,10.8 11.5,10.25 v11.55,10.25 | v57.55,39.6 58.06,40.11 CR1.17
  Top 0.61: 16.32,23.1 16.32,25.26
  Bottom 0.254: v57.55,39.6 54.85,39.6 53.9,38.65 53.02,38.65 v52.9,38.8 | v11.55,10.25 11.75,10.45 14.5,10.45 16.62,12.57 18.93,12.57 20.15,13.8 20.15,16.1 30.05,26 34.89,26 43.64,34.74 43.64,38.76 v43.6,38.8

### Text on the board
tNames: BULLBOTS / UGA 2019
Document: Notes / ----------------------- / Bottom layer - GND / Add net classes / Add power planes / Use vector font